# Altium project ARMflash_revC.PrjPcb (part 2 of 4)

## Sheet Pg06_ SysBoot_LEDS_Mech.SchDoc: SYSBOOT LED SENSORS
size A2; DocumentNumber: 6; Revision: C2; SheetNumber: 6; SheetTotal: 16
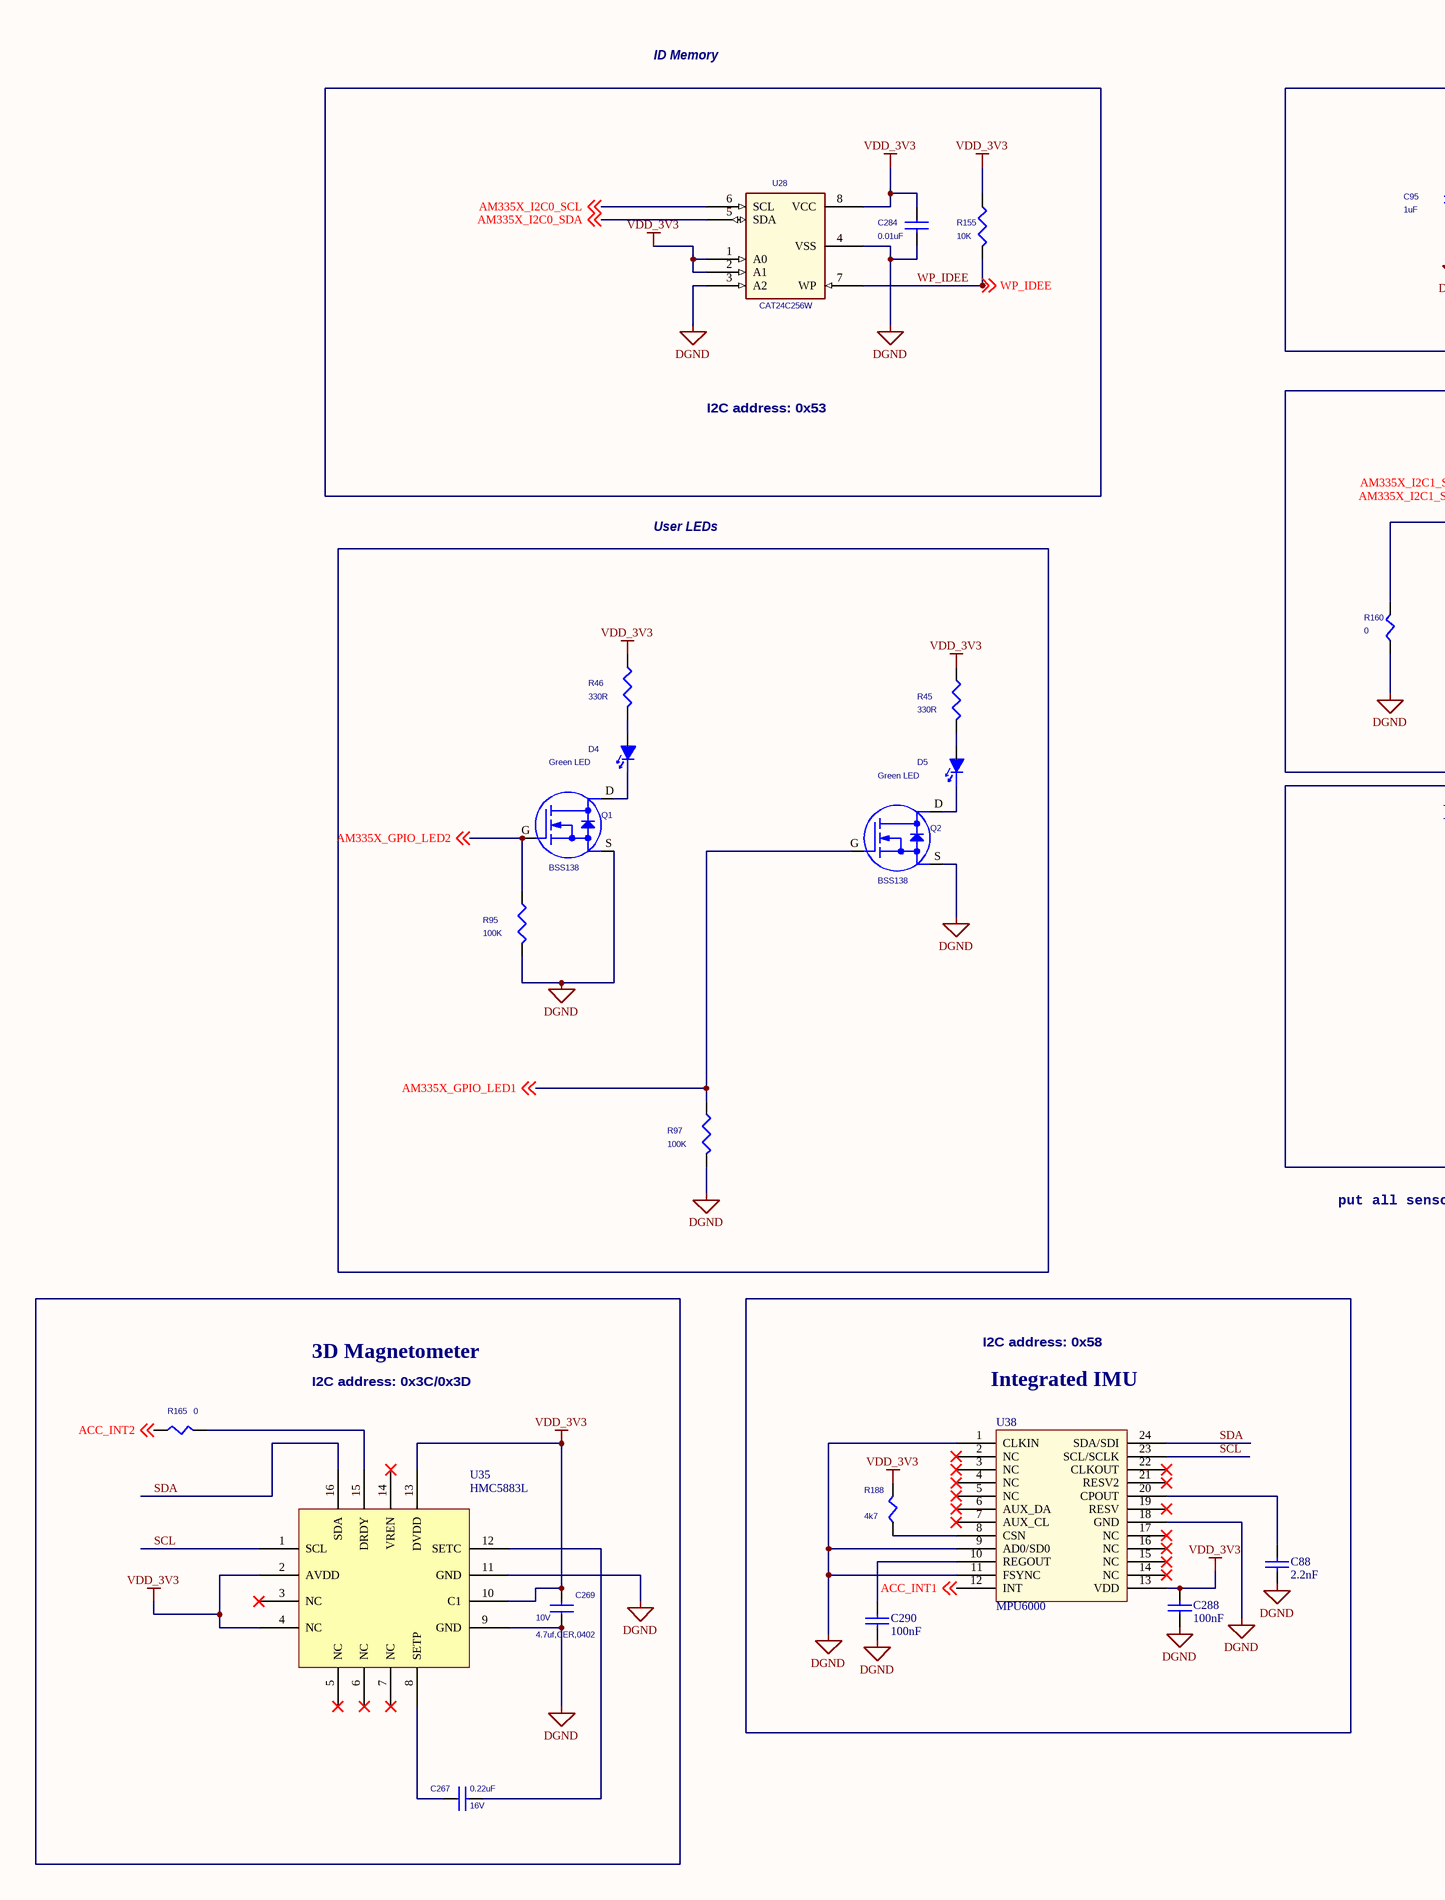
[diagram p7: Pg06_ SysBoot_LEDS_Mech.SchDoc, left]
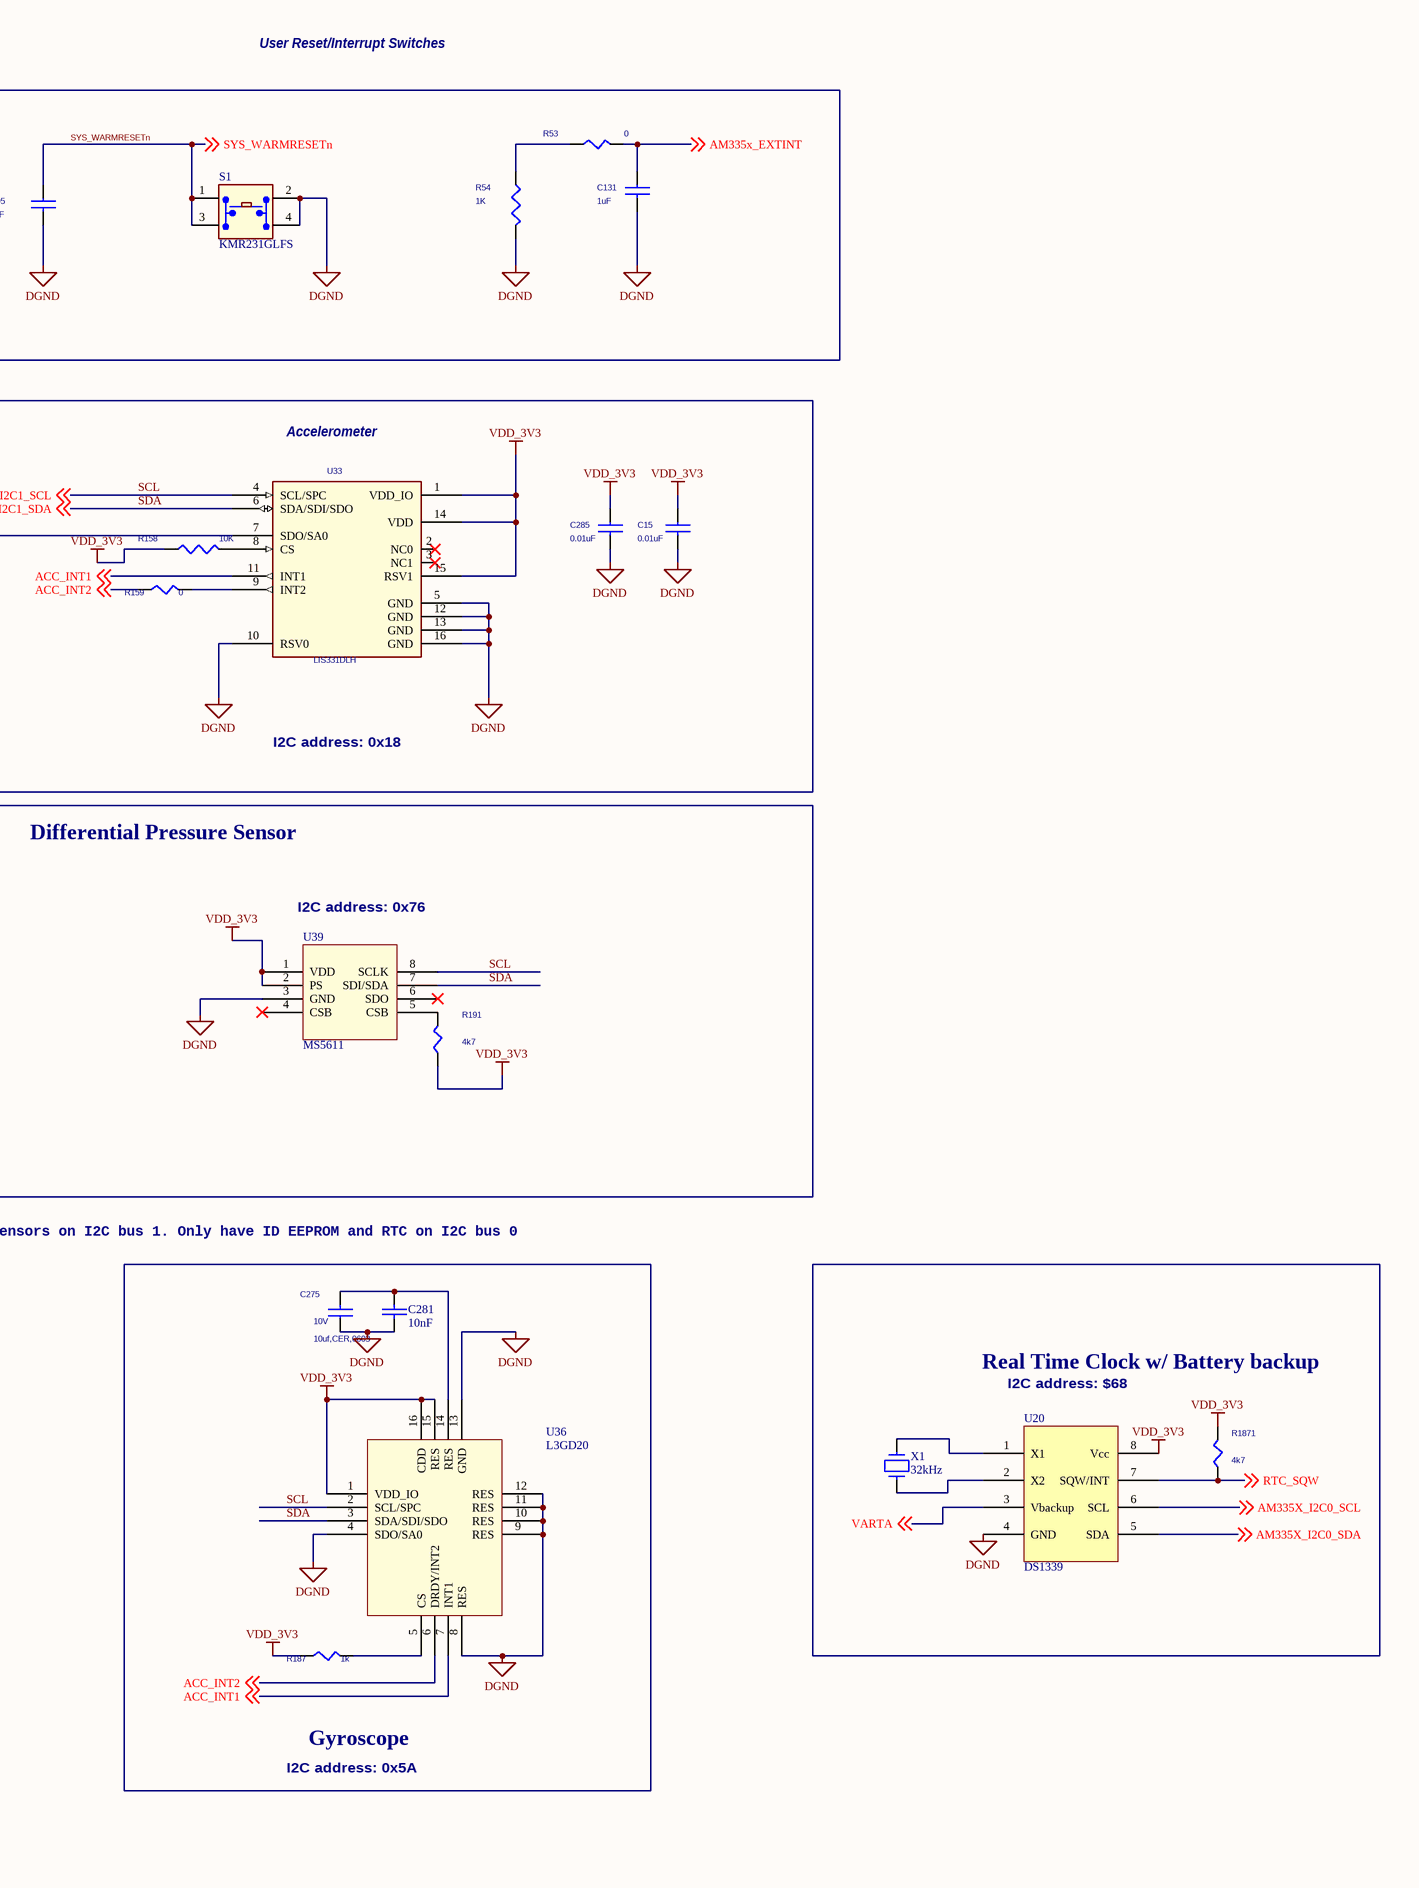
[diagram p8: Pg06_ SysBoot_LEDS_Mech.SchDoc, right]

### Parts
(Parts that share a designator on the sheet are numbered #1, #2 ... from top to bottom, then left to right.)
?#6  (no value)  (graphical)
C15  0.01uF  [SM-7351-CAP-0402]
C88  2.2nF  [0603]
C95  1uF  [SM-7351-CAP-0402]
C131  1uF  [SM-7351-CAP-0402]
C267  0.22uF  Voltage: 16V  [sc0402]
C269  4.7uf,CER,0402  Voltage: 10V  [sc0402]
C275  10uf,CER,0603  Voltage: 10V  [0603]
C281  10nF  [SM-7351-CAP-0402]
C284  0.01uF  [SM-7351-CAP-0402]
C285  0.01uF  [SM-7351-CAP-0402]
C288  100nF  [0603]
C290  100nF  [0603]
D4  Green LED  [sm_led_0805]
D5  Green LED  [sm_led_0805]
Q1  BSS138  [SOT23-3]
Q2  BSS138  [SOT23-3]
R45  330R  [SM-7351-RES-0402]
R46  330R  [SM-7351-RES-0402]
R53  0  [SM-7351-RES-0402]
R54  1K  [SM-7351-RES-0402]
R95  100K  [SM-7351-RES-0402]
R97  100K  [SM-7351-RES-0402]
R155  10K  [SM-7351-RES-0402]
R158  10K  [SM-7351-RES-0402]
R159  0  [SM-7351-RES-0402]
R160  0  [SM-7351-RES-0402]
R165  0  [SM-7351-RES-0402]
R187  1k  [SM-7351-RES-0402]
R188  4k7  [SM-7351-RES-0402]
R191  4k7  [SM-7351-RES-0402]
R1871  4k7  [SM-7351-RES-0402]
S1  KMR231GLFS  [SW4SMD_63X161LS]
U20  DS1339  [MSOP-MS8_N]
U28  CAT24C256W  [SOIC_8]
U33  LIS331DLH  [LGA16pin_3x3]
U35  HMC5883L  [LPCC package]
U36  L3GD20  [LCC 16pin 4x4mm 0.65mm pitch]
U38  MPU6000  [QFN_EPAD_24]
U39  MS5611  [MS5611-01BA03]
X1  32kHz  [Xtal 3215]

### Blocks framed on the sheet
I2C address: 0x53: C284 R155 U28
Accelerometer: C15 C285 R158-R160 U33
User LEDs: D4 D5 Q1 Q2 R45 R46 R95 R97
Differential Pressure Sensor: R191 U39
Gyroscope: C275 C281 R187 U36
Real Time Clock w/ Battery backup: R1871 U20 X1
3D Magnetometer: C267 C269 R165 U35
Integrated IMU: C88 C288 C290 R188 U38

### Nets
DGND: C15.2 C88.2 C95.2 C131.2 C269.1 C275.1 C281.2 C284.2 C285.2 C288.2 C290.2 Q1.S(SOURCE) Q2.S(SOURCE) R54.1(P1) R95.1(P1) R97.1(P1) R160.2(P2) S1.2(A2) S1.4 U20.4(GND) U28.3(A2) U28.4(VSS) U33.5(GND) U33.10(RSV0) U33.12(GND) U33.13(GND) U33.16(GND) U35.9(GND) U35.11(GND) U36.4(SDO/SA0) U36.8(RES) U36.9(RES) U36.10(RES) U36.11(RES) U36.12(RES) U36.13(GND) U38.1(CLKIN) U38.9(AD0/SD0) U38.11(FSYNC) U38.18(GND) U39.3(GND)
VDD_3V3: C15.1 C269.2 C284.1 C285.1 C288.1 R45.2(P2) R46.2(P2) R155.2(P2) R158.2(P2) R187.2(P2) R188.1(P1) R191.2(P2) R1871.1(P1) U20.8(Vcc) U28.1(A0) U28.2(A1) U28.8(VCC) U33.1(VDD_IO) U33.14(VDD) U33.15(RSV1) U35.2(AVDD) U35.4(NC) U35.10(C1) U35.13(DVDD) U36.1(VDD_IO) U36.15(RES) U36.16(CDD) U38.13(VDD) U39.1(VDD) U39.2(PS)  [project net VDD]
ACC_INT1: U33.11(INT1) U36.7(INT1) U38.12(INT) ; off-sheet ACC_INT1
ACC_INT2: R159.2(P2) R165.2(P2) U36.6(DRDY/INT2) ; off-sheet ACC_INT2
AM335x_EXTINT: C131.1 R53.1(P1) ; off-sheet AM335x_EXTINT
AM335X_GPIO_LED1: Q2.G(GATE) R97.2(P2) ; off-sheet AM335X_GPIO_LED1
AM335X_GPIO_LED2: Q1.G(GATE) R95.2(P2) ; off-sheet AM335X_GPIO_LED2  [project net TST1]
AM335X_I2C0_SCL: U20.6(SCL) U28.6(SCL) ; off-sheet AM335X_I2C0_SCL
AM335X_I2C0_SDA: U20.5(SDA) U28.5(SDA) ; off-sheet AM335X_I2C0_SDA
RTC_SQW: R1871.2(P2) U20.7(SQW/INT) ; off-sheet RTC_SQW
SCL: U33.4(SCL/SPC) U35.1(SCL) U36.2(SCL/SPC) U38.23(SCL/SCLK) U39.8(SCLK) ; off-sheet AM335X_I2C1_SCL  [also labelled AM335X_I2C1_SCL]
SDA: U33.6(SDA/SDI/SDO) U35.16(SDA) U36.3(SDA/SDI/SDO) U38.24(SDA/SDI) U39.7(SDI/SDA) ; off-sheet AM335X_I2C1_SDA  [also labelled AM335X_I2C1_SDA]
SYS_WARMRESETn: C95.1 S1.1(A1) S1.3(A3) ; off-sheet SYS_WARMRESETn  [project net ENET_RESETn]
VARTA: U20.3(Vbackup) ; off-sheet VARTA
WP_IDEE: R155.1(P1) U28.7(WP) ; off-sheet WP_IDEE
NetC88_1: C88.1 U38.20(CPOUT)
NetC267_1: C267.1 U35.8(SETP)
NetC267_2: C267.2 U35.12(SETC)
NetC275_2: C275.2 C281.1 U36.14(RES)
NetC290_1: C290.1 U38.10(REGOUT)
NetD4_1: D4.1(Cathode) Q1.D(DRAIN)
NetD4_2: D4.2(Anode) R46.1(P1)
NetD5_1: D5.1(Cathode) Q2.D(DRAIN)
NetD5_2: D5.2(Anode) R45.1(P1)
NetR53_2: R53.2(P2) R54.2(P2)
NetR158_1: R158.1(P1) U33.8(CS)
NetR159_1: R159.1(P1) U33.9(INT2)
NetR160_1: R160.1(P1) U33.7(SDO/SA0)
NetR165_1: R165.1(P1) U35.15(DRDY)
NetR187_1: R187.1(P1) U36.5(CS)
NetR188_2: R188.2(P2) U38.8(CSN)
NetR191_1: R191.1(P1) U39.5(CSB)
NetU20_1: U20.1(X1) X1.2
NetU20_2: U20.2(X2) X1.1

Not connected (* = marked no-connect by the designer): U33 2(NC0)* 3(NC1)*; U35 3(NC)* 5(NC)* 6(NC)* 7(NC)* 14(VREN)*; U38 2(NC)* 3(NC)* 4(NC)* 5(NC)* 6(AUX_DA)* 7(AUX_CL)* 14(NC)* 15(NC)* 16(NC)* 17(NC)* 19(RESV)* 21(RESV2)* 22(CLKOUT)*; U39 4(CSB)* 6(SDO)*

### Notes on the sheet
- ID Memory
- User Reset/Interrupt Switches
- I2C address: 0x18
- I2C address: 0x76
- put all sensors on I2C bus 1. Only have ID EEPROM and RTC on I2C bus 0
- I2C address: 0x3C/0x3D
- I2C address: 0x58
- I2C address: $68
- I2C address: 0x5A
- Embedded Vision Systems Group
- Title
- School of Electrical and Electronic Engineering
- Date:
- Size
- Document Number
- Sheet
- of
- Rev

### Library data of the parts
?#6 = Title Block Address(1): UoM title block
C15 C284 C285 = 0.01uFCapacitor16V10%0402_Dup1: as C4 on sheet Pg04_ AM335X Section 3 
C88 C281 C288 C290 = CAP_CER: Ceramic capacitor
C95 C131 = 1uFCapacitor10V10%0402_Dup1: PartName: 1uF10V10%0402; Mfr: AVX; MfrNum: 0402ZD105KAT2A; TIIntPartnumber: 1C0084; Vendor: Digikey; Cost100: 0.336; Cost10K: 0.201; DescriptiveText: Capacitor 1uF 10V Ceramic 10% 0402
C267 = 0402_0r01uf_x7r_16v_10: TN: 207-0054-000; Desc: CAP, CER, X7R, 0402, 16V, 10%, 0.01uF
C269 C275 = cap_0402_0r1uf_x7r_10v: Desc: CAP, CER, X7R, 0402, 10V, 10%, 0.1uF
D4 D5 = LED_Green: TIIntPartnumber: 1F0008; MfrNum: 598-8170-107F; Mfr: Dialight; PartName: LEDGreen2x1.5; DescriptiveText: LED Green SMD 20mA 2V 0805; Cost10K: 0.0370; Cost100: 0.081; Vendor: Digikey
Q1 Q2 = MOSFET_NChan_BSS138_Dup1: MOSFET Nchan 50V 200mA; TIIntPartnumber: 1Q0019; MfrNum: BSS138-7-F; Mfr: Diodes Inc.; Cost10K: 0.030; Cost100: 0.18; Vendor: Digikey; TN: 289-0091-000; Descriptive_Text: MOSFET Nchan 50V 200mA; PartName: MOSFET_NChan_BSS138; DescriptiveText: MOSFET Nchan 50V 200mA
R45 R46 = 150ohm1/16W1%SMD0402: Resistor 150ohm 1/16W 5% 0402; Mfr: Stackpole Electronics; MfrNum: RMCF0402JT150R; TIIntPartnumber: 1R0179; Vendor: Digikey; Cost100: 0.011; Cost10K: 0.00132; DescriptiveText: Resistor 150ohm 1/16W 5% 0402; PartName: 150ohm1/16W5%0402; Descriptive_Text: Resistor 150ohm 1/16W 5% 0402
R53 = ZeroOhmResistor1/16W0402_Dup1: Resistor Zero ohm Jumper 0402; TIIntPartnumber: 1R0098; MfrNum: ERJ-2GE0R00X; Mfr: Panasonic; PartName: ZeroohmSMD0402; Cost10K: 0.0020; Cost100: 0.08; Vendor: DIGIKEY; Descriptive_Text: Resistor Zero ohm Jumper 0402; DescriptiveText: Resistor Zero ohm Jumper 0402
R54 = 1KOhmResistor1/16W0402_Dup1: Resistor 1Kohm 1/16W 5% 0402; PartName: 1KOHM1/16W5%SMD; Mfr: Panasonic; MfrNum: ERJ-2GEJ102X; TIIntPartnumber: 1R0027; Vendor: DIGIKEY; Cost100: 0.02595; Descriptive_Text: Resistor 1Kohm 1/16W 5% 0402; Cost10K: 0.02595; DescriptiveText: Resistor 1Kohm 1/16W 5% 0402
R95 R97 = 100KOhmResistor1/16W0402_Dup1: TIIntPartnumber: 1R0181; MfrNum: RMCF0402FT100K; Mfr: Stackpole Electronics; PartName: 100Kohm1/16W1%SMD0402; DescriptiveText: Resistor 100Kohm 1/16W 1% 0402; Cost10K: 0.0020; Cost100: 0.0105; Vendor: Digikey
R155 R158 = 10KOhmResistor1/16W0402_Dup1: as R44 on sheet Pg02_ AM335X Section 1 ; Descriptive_Text: Resistor 10Kohm 1/16W 5% 0402; DescriptiveText: Resistor 10Kohm 1/16W 5% 0402
R159 R165 R187 R188 R191 R1871 = ZeroOhmResistor1/16W0402: PartName: ZeroohmSMD0402; Mfr: Panasonic; MfrNum: ERJ-2GE0R00X; TIIntPartnumber: 1R0098; DescriptiveText: Resistor Zero ohm Jumper 0402; Vendor: Digikey; Cost100: 0.08; Cost10K: 0.0020
R160 = ZeroOhmResistor1/16W0402_Dup4: as R67 on sheet Pg03_ AM335X Section 2 ; Descriptive_Text: Resistor Zero ohm Jumper 0402; DescriptiveText: Resistor Zero ohm Jumper 0402
S1 = KMR2: Microminiature Tact Switch for SMT; Manufacturer: C&K Components; Circuit: SPST-NO; Switch Function: Off-Mom; Contact Rating @ Voltage: 0.05A @ 32VDC; Actuator Type: Standard; Actuator Height off PCB, from Pins: 1.90mm; Actuator Orientation: Top Actuated; Outline: 4.60mm x 2.80mm; Illumination: Non-Illuminated; Operating Force: 300gf; Switch Travel: 0.25mm; Mechanical Life: 150,000 Cycles; Supplier 1: Digi-Key; Supplier Part Number 1: 401-1429-6-ND; Manufacturer Part Number: KMR231GLFS; RoHS: RoHS Compliant; Category: Switches; Stock 1: 32289; Pricing 1: 1=0.44, 10=0.416, 25=0.3744, 50=0.3326, 100=0.3188, 250=0.29108, 500=0.2772, 1000=0.22869 (USD); Mounting Type: Surface Mount; Termination Style: Gull Wing; Illumination Voltage (Nominal): -; Illumination Type, Color: -; Ingress Protection: -; Features: Grounding Pin; Packaging: Digi-Reel®; Actuator Material: -; Operating Temperature: -40°C ~ 85°C; ComponentLink1URL: http://www.ck-components.com/index.php?module=media&action=Display&cmpref=14414&lang=en&width=&height=&format=&alt=; ComponentLink1Description: http://www.ck-components.com/index.php?module=media&action=Display&cmpref=14414&lang=en&width=&height=&format=&alt=
U20 = DS1339: DS1339 RTC; Farnell: 1379717
U28 = CAT24C256W: EEPROM 256Kb I2C SOIC8; TIIntPartnumber: 1A0225; MfrNum: CAT24C256WI-G; Mfr: On Semiconductor; Cost10K: 0.36; Cost100: 1.21; Vendor: Digikey; DescriptiveText: EEPROM 256Kb I2C SOIC8; PartName: CAT24C256W; Descriptive_Text: EEPROM 256Kb I2C SOIC8
U33 = LIS331DLH: Accelerometer 3 Axis I2C; Mfr: ST Microelectronics; TIIntPartnumber: 1A0227; Vendor: Digikey; Cost100: 8.05; Cost10K: 2.25; DescriptiveText: Accelerometer 3 Axis I2C; PartName: LIS331DLH; MfrNum: LIS331DLH; Descriptive_Text: Accelerometer 3 Axis I2C
U35 = HMC5883L: 3D Magnetometer
U38 = IMU6000: Invensemse 6-axis MPU; supplier: Digikey  1428-1005-1-ND
U39 = MS5611: Pressure Sensor; supplier: Avnet
X1 = CRYSTAL

## Sheet Pg07_ DDR3_Memory.SchDoc: DDR3 MEMORY
size A2; DrawnBy: RvS; DocumentNumber: 7; Revision: C2; SheetNumber: 7; SheetTotal: 16
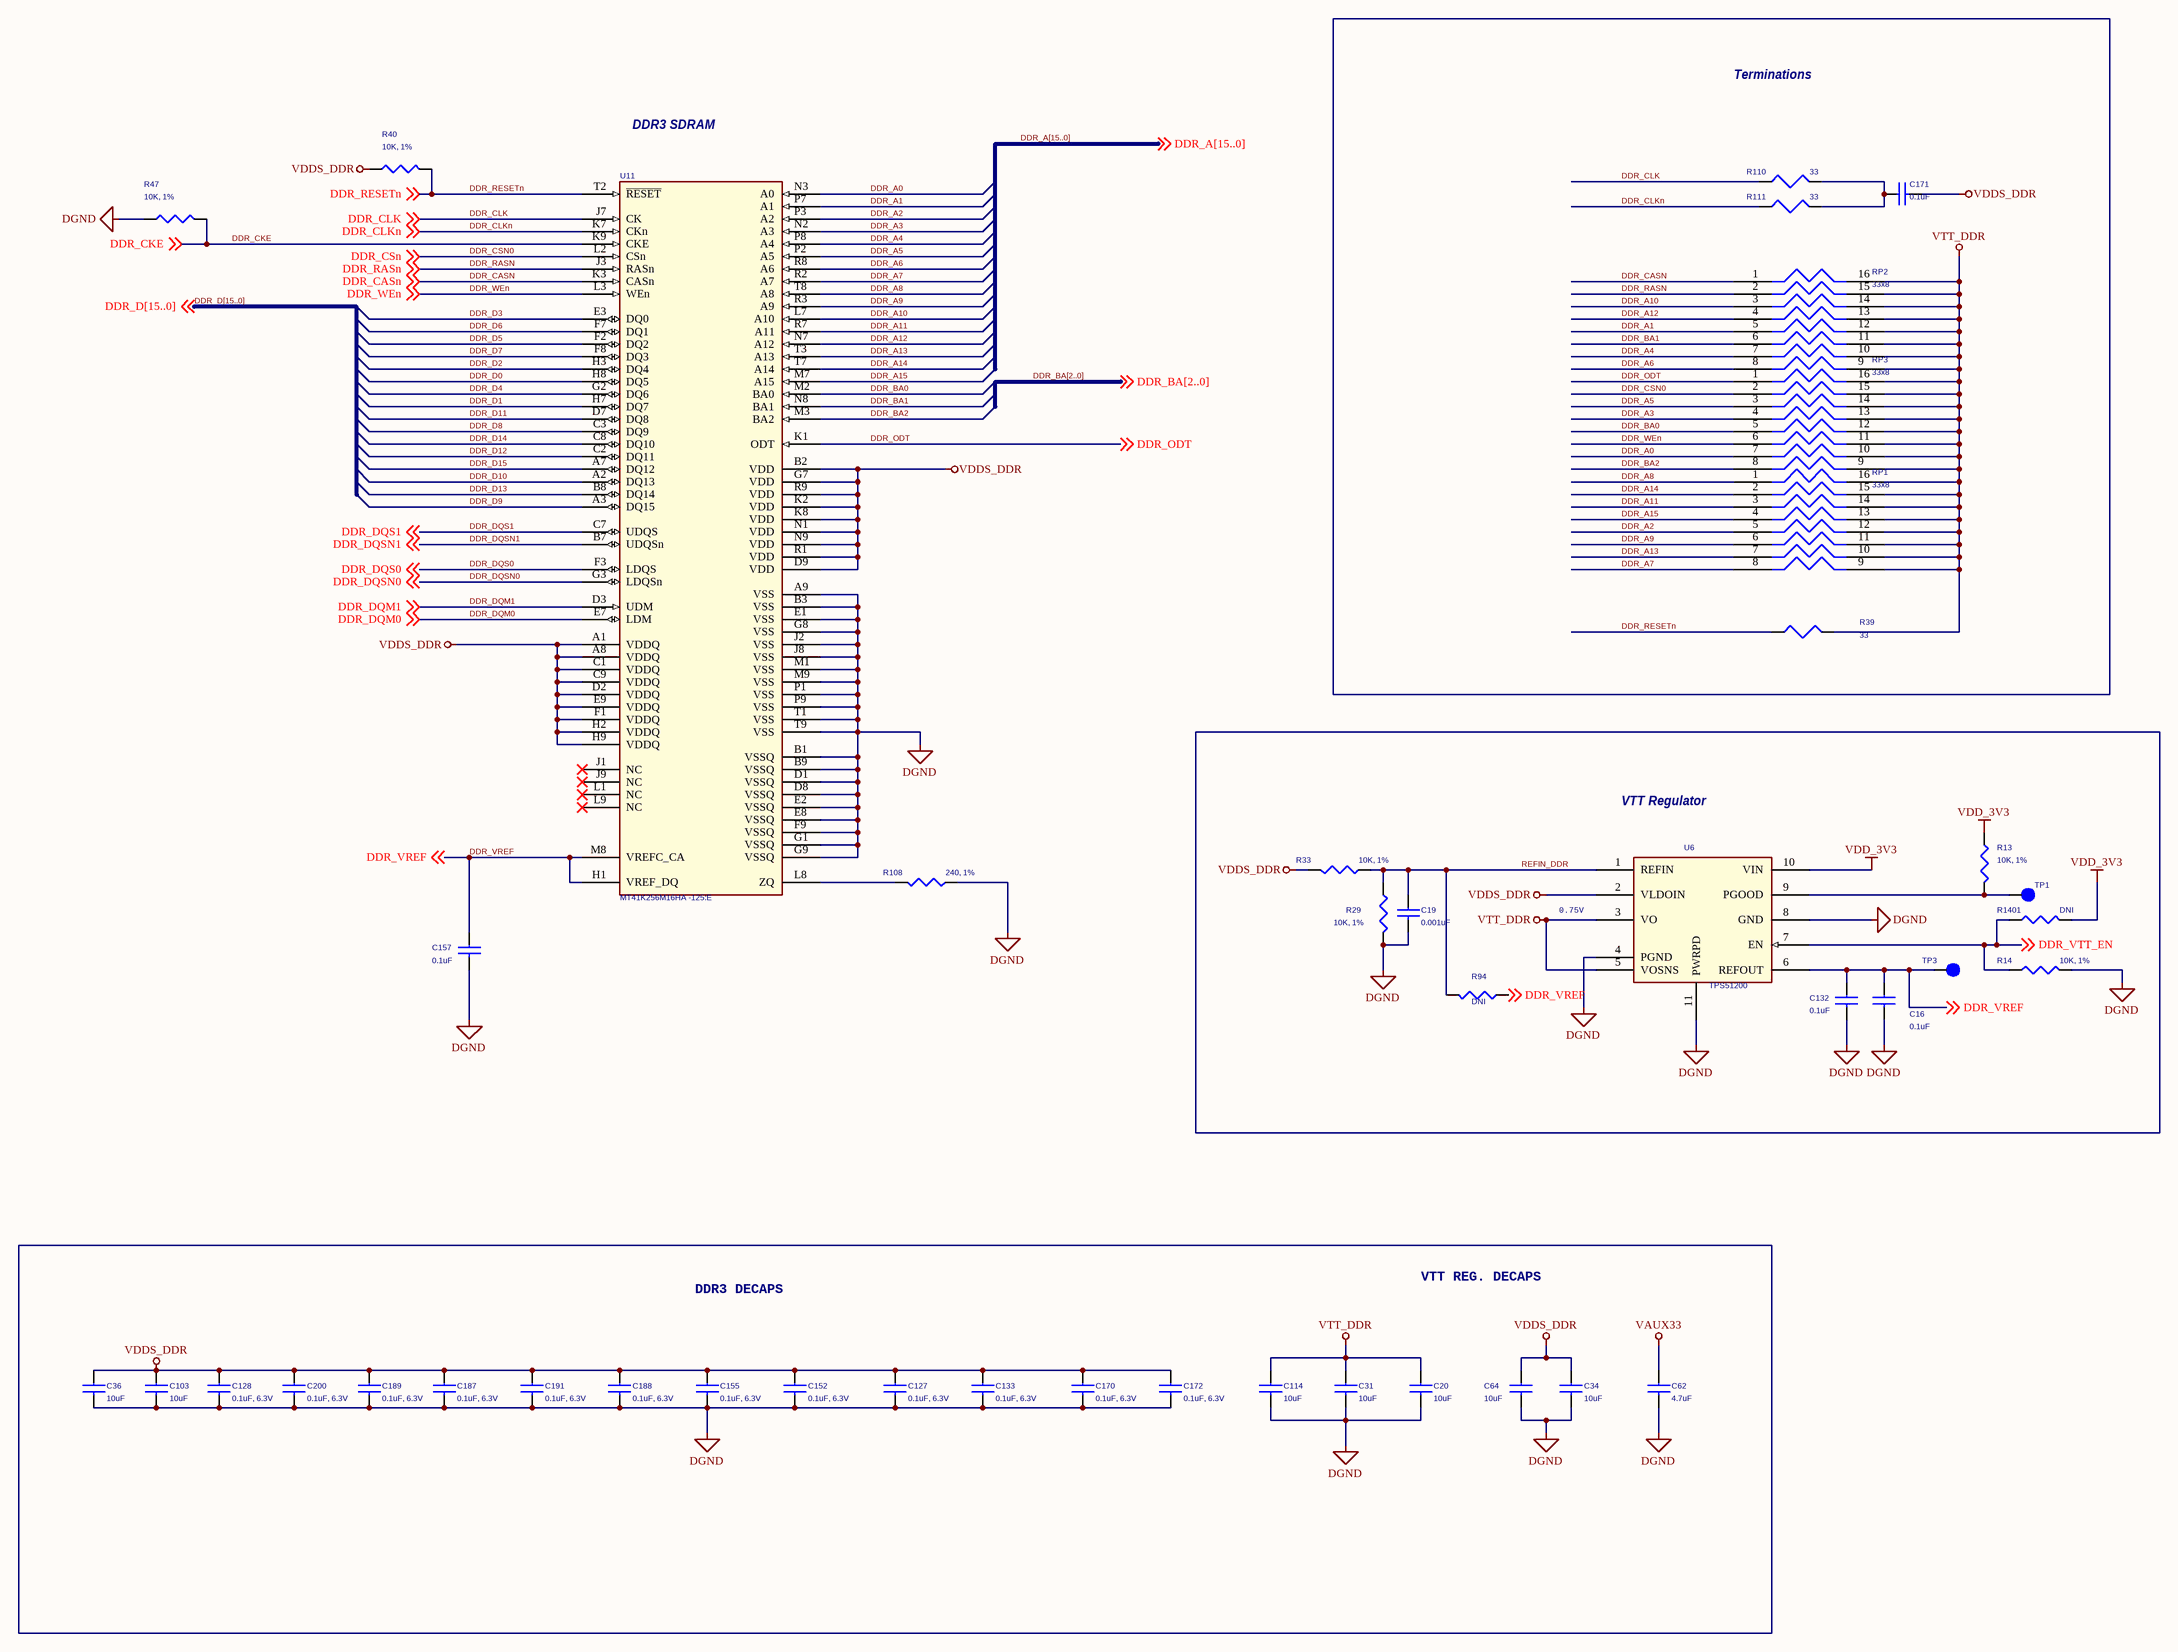
[diagram p9: Pg07_ DDR3_Memory.SchDoc]

### Parts
(Parts that share a designator on the sheet are numbered #1, #2 ... from top to bottom, then left to right.)
?#7  (no value)  (graphical)
C16  0.1uF  [SM-7351-CAP-0402]
C19  0.001uF  [SM-7351-CAP-0402]
C20  10uF  [SM-7351-CAP-0805]
C31  10uF  [SM-7351-CAP-0805]
C34  10uF  [SM-7351-CAP-0805]
C36  10uF  [SM-7351-CAP-0805]
C62  4.7uF  [SM-7351-CAP-0603]
C64  10uF  [SM-7351-CAP-0805]
C103  10uF  [SM-7351-CAP-0805]
C114  10uF  [SM-7351-CAP-0805]
C127  0.1uF, 6.3V  [SM-7351-CAP-0402]
C128  0.1uF, 6.3V  [SM-7351-CAP-0402]
C132  0.1uF  [SM-7351-CAP-0402]
C133  0.1uF, 6.3V  [SMD0201]
C152  0.1uF, 6.3V  [SM-7351-CAP-0402]
C155  0.1uF, 6.3V  [SMD0201]
C157  0.1uF  [SM-7351-CAP-0402]
C170  0.1uF, 6.3V  [SM-7351-CAP-0402]
C171  0.1uF  [SM-7351-CAP-0402]
C172  0.1uF, 6.3V  [SM-7351-CAP-0402]
C187  0.1uF, 6.3V  [SM-7351-CAP-0402]
C188  0.1uF, 6.3V  [SM-7351-CAP-0402]
C189  0.1uF, 6.3V  [SM-7351-CAP-0402]
C191  0.1uF, 6.3V  [SM-7351-CAP-0402]
C200  0.1uF, 6.3V  [SMD0201]
R13  10K, 1%  [SM-7351-RES-0402]
R14  10K, 1%  [SM-7351-RES-0402]
R29  10K, 1%  [SM-7351-RES-0402]
R33  10K, 1%  [SM-7351-RES-0402]
R39  33  [SM-7351-RES-0402]
R40  10K, 1%  [SM-7351-RES-0402]
R47  10K, 1%  [SM-7351-RES-0402]
R94  DNI  [SM-7351-RES-0402]
R108  240, 1%  [SM-7351-RES-0402]
R110  33  [SM-7351-RES-0402]
R111  33  [SM-7351-RES-0402]
R1401  DNI  [SM-7351-RES-0402]
RP1  33x8  [sm_rpak_exb-2hv]
RP2  33x8  [sm_rpak_exb-2hv]
RP3  33x8  [sm_rpak_exb-2hv]
TP1  TP1mm  [tp_smd1mmcircle]  (value not drawn)
TP3  TP1mm  [tp_smd1mmcircle]  (value not drawn)
U6  TPS51200  [SON10]
U11  MT41K256M16HA -125:E  [BGA14X10-96]

### Blocks framed on the sheet
Terminations: C171 R39 R110 R111 RP1-RP3
VTT Regulator: C16 C19 C132 R13 R14 R29 R33 R94 R1401 TP1 TP3 U6

### Nets
DGND: C16.2 C19.2 C20.2 C31.2 C34.2 C36.2 C62.2 C64.2 C103.2 C114.2 C127.2 C128.2 C132.2 C133.2 C152.2 C155.2 C157.2 C170.2 C172.2 C187.2 C188.2 C189.2 C191.2 C200.2 R14.2 R29.2 R47.1 R108.1 U6.4(PGND) U6.8(GND) U6.11(PWRPD) U11.A9(VSS) U11.B1(VSSQ) U11.B3(VSS) U11.B9(VSSQ) U11.D1(VSSQ) U11.D8(VSSQ) U11.E1(VSS) U11.E2(VSSQ) U11.E8(VSSQ) U11.F9(VSSQ) U11.G1(VSSQ) U11.G8(VSS) U11.G9(VSSQ) U11.J2(VSS) U11.J8(VSS) U11.M1(VSS) U11.M9(VSS) U11.P1(VSS) U11.P9(VSS) U11.T1(VSS) U11.T9(VSS)
VAUX33: C62.1
VDD_3V3: R13.1 R1401.2 U6.10(VIN)  [project net VDD]
VDDS_DDR: C34.1 C36.1 C64.1 C103.1 C127.1 C128.1 C133.1 C152.1 C155.1 C170.1 C171.2 C172.1 C187.1 C188.1 C189.1 C191.1 C200.1 R33.2 R40.1 U6.2(VLDOIN) U11.A1(VDDQ) U11.A8(VDDQ) U11.B2(VDD) U11.C1(VDDQ) U11.C9(VDDQ) U11.D2(VDDQ) U11.D9(VDD) U11.E9(VDDQ) U11.F1(VDDQ) U11.G7(VDD) U11.H2(VDDQ) U11.H9(VDDQ) U11.K2(VDD) U11.K8(VDD) U11.N1(VDD) U11.N9(VDD) U11.R1(VDD) U11.R9(VDD)
VTT_DDR: C20.1 C31.1 C114.1 R39.2 RP1.9 RP1.10 RP1.11 RP1.12 RP1.13 RP1.14 RP1.15 RP1.16 RP2.9 RP2.10 RP2.11 RP2.12 RP2.13 RP2.14 RP2.15 RP2.16 RP3.9 RP3.10 RP3.11 RP3.12 RP3.13 RP3.14 RP3.15 RP3.16 U6.3(VO) U6.5(VOSNS)
DDR_A0: RP3.7 U11.N3(A0)
DDR_A1: RP2.5 U11.P7(A1)
DDR_A2: RP1.5 U11.P3(A2)
DDR_A3: RP3.4 U11.N2(A3)
DDR_A4: RP2.7 U11.P8(A4)
DDR_A5: RP3.3 U11.P2(A5)
DDR_A6: RP2.8 U11.R8(A6)
DDR_A7: RP1.8 U11.R2(A7)
DDR_A8: RP1.1 U11.T8(A8)
DDR_A9: RP1.6 U11.R3(A9)
DDR_A10: RP2.3 U11.L7(A10)
DDR_A11: RP1.3 U11.R7(A11)
DDR_A12: RP2.4 U11.N7(A12)
DDR_A13: RP1.7 U11.T3(A13)
DDR_A14: RP1.2 U11.T7(A14)
DDR_A15: RP1.4 U11.M7(A15)
DDR_BA0: RP3.5 U11.M2(BA0)
DDR_BA1: RP2.6 U11.N8(BA1)
DDR_BA2: RP3.8 U11.M3(BA2)
DDR_CASn: RP2.1 U11.K3(CASn) ; off-sheet DDR_CASn
DDR_CKE: R47.2 U11.K9(CKE) ; off-sheet DDR_CKE
DDR_CLK: R110.1 U11.J7(CK) ; off-sheet DDR_CLK
DDR_CLKn: R111.1 U11.K7(CKn) ; off-sheet DDR_CLKn
DDR_CSn: RP3.2 U11.L2(CSn) ; off-sheet DDR_CSn  [also labelled DDR_CSN0]
DDR_D0: U11.H8(DQ5)
DDR_D1: U11.H7(DQ7)
DDR_D2: U11.H3(DQ4)
DDR_D3: U11.E3(DQ0)
DDR_D4: U11.G2(DQ6)
DDR_D5: U11.F2(DQ2)
DDR_D6: U11.F7(DQ1)
DDR_D7: U11.F8(DQ3)
DDR_D8: U11.C3(DQ9)
DDR_D9: U11.A3(DQ15)
DDR_D10: U11.A2(DQ13)
DDR_D11: U11.D7(DQ8)
DDR_D12: U11.C2(DQ11)
DDR_D13: U11.B8(DQ14)
DDR_D14: U11.C8(DQ10)
DDR_D15: U11.A7(DQ12)
DDR_DQM0: U11.E7(LDM) ; off-sheet DDR_DQM0
DDR_DQM1: U11.D3(UDM) ; off-sheet DDR_DQM1
DDR_DQS0: U11.F3(LDQS) ; off-sheet DDR_DQS0
DDR_DQS1: U11.C7(UDQS) ; off-sheet DDR_DQS1
DDR_DQSN0: U11.G3(LDQSn) ; off-sheet DDR_DQSN0
DDR_DQSN1: U11.B7(UDQSn) ; off-sheet DDR_DQSN1
DDR_ODT: RP3.1 U11.K1(ODT) ; off-sheet DDR_ODT
DDR_RASn: RP2.2 U11.J3(RASn) ; off-sheet DDR_RASn
DDR_RESETn: R39.1 R40.2 U11.T2(~{RESET}) ; off-sheet DDR_RESETn
DDR_VREF: C16.1 C132.1 C157.1 R94.1 TP3.1 U6.6(REFOUT) U11.H1(VREF_DQ) U11.M8(VREFC_CA) ; off-sheet DDR_VREF
DDR_VTT_EN: R14.1 R1401.1 U6.7(EN) ; off-sheet DDR_VTT_EN
DDR_WEn: RP3.6 U11.L3(WEn) ; off-sheet DDR_WEn
REFIN_DDR: C19.1 R29.1 R33.1 R94.2 U6.1(REFIN)
NetC171_1: C171.1 R110.2 R111.2
NetR13_2: R13.2 TP1.1 U6.9(PGOOD)
NetR108_2: R108.2 U11.L8(ZQ)

Not connected (* = marked no-connect by the designer): U11 J1(NC)* J9(NC)* L1(NC)* L9(NC)*

### Buses and harness runs
bus DDR_A[15..0]
bus DDR_BA[2..0]
bus DDR_D[15..0]

### Notes on the sheet
- DDR3 SDRAM
- 0.75V
- VTT REG. DECAPS
- DDR3 DECAPS
- Embedded Vision Systems Group
- Title
- School of Electrical and Electronic Engineering
- Date:
- Size
- Document Number
- Sheet
- of
- Rev

### Library data of the parts
?#7 = Title Block Address(1): UoM title block
C16 C132 C157 C171 = 0.1uFCapacitor16V10%0402_Dup1: TIIntPartnumber: 1C0089; MfrNum: C0402C104K4RACT; Mfr: Kemet; PartName: 0.1uF16V10%SMD0402; DescriptiveText: Capacitor 0.1uF 16V 10% 0402 X7R; Cost10K: 0.015; Cost100: 0.11; Vendor: Digikey
C19 = 0.001uFCapacitor50V5%0402: Mfr: AVX; PartName: 0.001uF50V5%SMD0402; MfrNum: 04025C102JAT2A; TIIntPartnumber: 1C0093; PN: 0402YC103KAT2A; TN: 207-0054-000; Vendor: Digikey; Cost100: 0.015; Cost10K: 0.007; DescriptiveText: Capacitor 0.001uF 50V 5% 0402
C20 C31 C34 C36 C64 C103 C114 = 10uFCapacitor16V10%0805: Capacitor 10uF 16V 10% Ceramic 0805; PartName: 10uF16V10%SMD0805; Mfr: AVX; MfrNum: 0805YD106KAT2A; TIIntPartnumber: 1C0085; Vendor: Digikey; Cost100: 0.19; Cost10K: 0.042; Descriptive_Text: Capacitor 10uF 16V 10% Ceramic 0805; DescriptiveText: Capacitor 10uF 16V 10% Ceramic 0805
C62 = 4.7uFCapacitor16V10%0603: TIIntPartnumber: 1C0103; MfrNum: EMK107ABJ475KA-T; Mfr: Taiyo Yuden; PartName: 4.7uF16V10%SMD0603; Cost10K: 0.00590; Cost100: 0.0198; Vendor: Digikey; DescriptiveText: Capacitor Ceramic 4.7uF 16V 10% 0603
C127 C128 C133 C152 C155 C170 C172 C187-C189 C191 C200 = 0.1uFCapacitor6.3V10%0201: PartName: 0.1uF6.3V10%smd0201; Mfr: Murata; MfrNum: GRM033R60J104KE19D; TIIntPartnumber: 1C0122; Vendor: Digikey; Cost100: 0.029; Cost10K: 0.0090; DescriptiveText: Capacitor 0.1uF 6.3V 10% 0201 X5R
R13 R29 R33 R94 = 10KOhmResistor1/10W1%0402_Dup3: TIIntPartnumber: 1R0254; MfrNum: ERJ-2RKF1002X; Mfr: Panasonic-ECG; PartName: 10Kohm1/10W1%smd0402; DescriptiveText: Resistor 10Kohm 1/10W 1% 0402; Cost10K: 0.00291; Cost100: 0.011; Vendor: Digikey
R14 R1401 = 10KOhmResistor1/10W1%0402: TIIntPartnumber: 1R0254; MfrNum: ERJ-2RKF1002X; Mfr: Panasonic-ECG; PartName: 10Kohm1/10W1%smd0402; DescriptiveText: Resistor 10Kohm 1/10W 1% 0402; Cost10K: 0.00291; Cost100: 0.011; Vendor: Digikey
R39 R110 R111 = 33ohmResistor1/16W5%0402: Resistor 33ohm 1/16W 5% 0402; PartName: 33ohm1/16W5%SMD; Mfr: Panasonic; MfrNum: ERJ-2GEJ330X; TIIntPartnumber: 1R0008; Vendor: Digikey; Cost100: 0.02595; Cost10K: 0.0020; Descriptive_Text: Resistor 33ohm 1/16W 5% 0402; DescriptiveText: Resistor 33ohm 1/16W 5% 0402
R40 R47 = 10KOhmResistor1/10W1%0402_Dup1: TIIntPartnumber: 1R0254; MfrNum: ERJ-2RKF1002X; Mfr: PANASONIC-ECG; PartName: 10Kohm1/10W1%smd0402; DescriptiveText: Resistor 10Kohm 1/10W 1% 0402; Cost10K: 0.00291; Cost100: 0.011; Vendor: DIGIKEY
R108 = 240OhmResistor1/10W1%0402: PartName: 240ohm1/10W1%smd0402; Mfr: Panasonic-ECG; MfrNum: ERJ-2RKF2400X; TIIntPartnumber: 1R0249; Vendor: Digikey; Cost100: 0.02; Cost10K: 0.00132; DescriptiveText: Resistor 240 OHM 1/10W 1% 0402 SMD
RP1-RP3 = 33ohmx8_1/16W5%smd: Resistor 33ohmx8 1/16W 5% Array SMD; Mfr: Panasonic; MfrNum: EXB-2HV330JV; TIIntPartnumber: 1R0196; Vendor: Digikey; Cost100: 0.007; Cost10K: 0.02465; DescriptiveText: Resistor 33ohmx8 1/16W 5% Array SMD; PartName: 33ohmx8_1/16W5%smd; Descriptive_Text: Resistor 33ohmx8 1/16W 5% Array SMD
TP1 TP3 = Testpoint_SMD1mmCircle: Testpoint SMD 1mm circle pad; TIIntPartnumber: 2H0046; Cost10K: 0.00; Cost100: 0; Descriptive_Text: Testpoint SMD 1mm circle pad; Vendor: N/A; MfrNum: N/A; Mfr: N/A; PartName: TestpointSMD1mmCircle; DescriptiveText: Testpoint SMD 1mm circle pad
U6 = TPS51200: TIIntPartnumber: 1A0297; MfrNum: TPS51200DRC; Mfr: TI; Cost10K: 0.39; Cost100: 1.11; Vendor: Digikey; DescriptiveText: DDR Termination Regulator SinkSource; PartName: TPS51200
U11 = MT41K256M16HA: DDR2 SDRAM 2Gb (256Mx8); Manufacturer: Micron Technology; Lead Time: 0 weeks; Peak Solder Temperature: 260 deg C; Supplier 1: Arrow; Supplier Part Number 1: 52128708S9959891N2406; Manufacturer Part Number: MT41K256M16HA-125:E; RoHS: CHINA ROHS: Compliant / EU ROHS: Compliant; Stock 1: 0; Pricing 1: 0=10.09 (USD); Package Quantity: 1; Termination Finish: Sn/Ag/Cu; China ROHS Lead (X -> above / O -> below threshold): O; China ROHS Mercury (X -> above / O -> below threshold): O; China ROHS Cadmium (X -> above / O -> below threshold): O; China ROHS Hex Chromium (X -> above / O -> below threshold): O; China ROHS PBB (X -> above / O -> below threshold): O; China ROHS PBDE (X -> above / O -> below threshold): O; EU_ROHS_PROD_EXEMPTION_BY_SUPP: N/R; ComponentLink1URL: http://components.arrow.com/partservice/dataview/altium/52128708S9959891N2406?apiKey=aa438727d59eed98c4bed826d8d949c84cb5e685b92bf87346a0226bd2658797; ComponentLink1Description: http://components.arrow.com/partservice/dataview/altium/52128708S9959891N2406?apiKey=aa438727d59eed98c4bed826d8d949c84cb5e685b92bf87346a0226bd2658797

## Sheet Pg08_HDMI.SchDoc: HDMI FRAMER CONNECTIVITY
size A3; DrawnBy: RvS; DocumentNumber: 8; Revision: C2; SheetNumber: 8; SheetTotal: 16
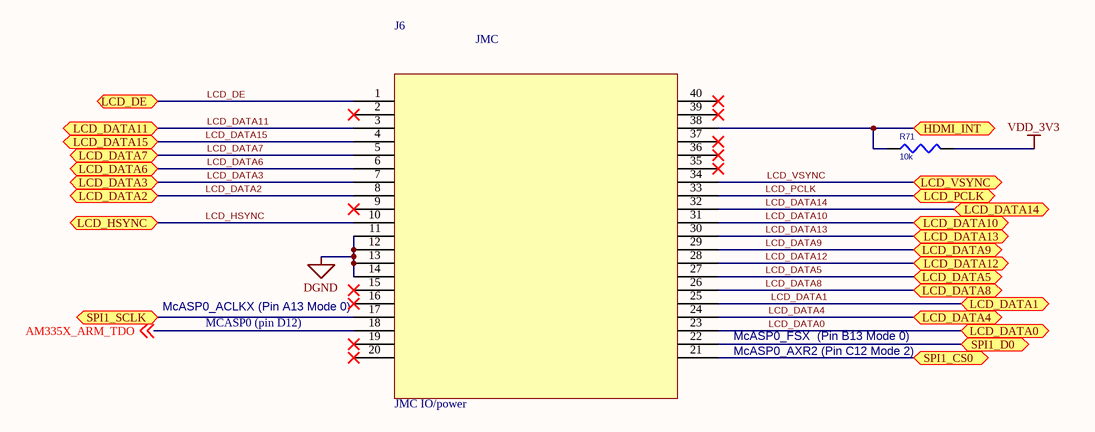
[diagram p10: Pg08_HDMI.SchDoc]

### Parts
(Parts that share a designator on the sheet are numbered #1, #2 ... from top to bottom, then left to right.)
?#8  (no value)  (graphical)
J6  JMC IO/power  [40 Pin Female]
R71  10k  [402]

### Ports
HDMI_INT, LCD_DATA0, LCD_DATA1, LCD_DATA2, LCD_DATA3, LCD_DATA4, LCD_DATA5, LCD_DATA6, LCD_DATA7, LCD_DATA8, LCD_DATA9, LCD_DATA10, LCD_DATA11, LCD_DATA12, LCD_DATA13, LCD_DATA14, LCD_DATA15, LCD_DE, LCD_HSYNC, LCD_PCLK, LCD_VSYNC, SPI1_CS0, SPI1_D0, SPI1_SCLK

### Nets
DGND: J6.11 J6.12 J6.13 J6.14
VDD_3V3: R71.1(P1)  [project net VDD]
AM335X_ARM_TDO: J6.18 ; off-sheet AM335X_ARM_TDO  [project net ARM_TDO]
LCD_DATA0: J6.23 ; port LCD_DATA0  [project net AM335X_LCD_DATA0]
LCD_DATA1: J6.25 ; port LCD_DATA1  [project net AM335X_LCD_DATA1]
LCD_DATA2: J6.8 ; port LCD_DATA2  [project net AM335X_LCD_DATA2]
LCD_DATA3: J6.7 ; port LCD_DATA3  [project net AM335X_LCD_DATA3]
LCD_DATA4: J6.24 ; port LCD_DATA4  [project net AM335X_LCD_DATA4]
LCD_DATA5: J6.27 ; port LCD_DATA5  [project net AM335X_LCD_DATA5]
LCD_DATA6: J6.6 ; port LCD_DATA6  [project net AM335X_LCD_DATA6]
LCD_DATA7: J6.5 ; port LCD_DATA7  [project net AM335X_LCD_DATA7]
LCD_DATA8: J6.26 ; port LCD_DATA8  [project net AM335X_LCD_DATA8]
LCD_DATA9: J6.29 ; port LCD_DATA9  [project net AM335X_LCD_DATA9]
LCD_DATA10: J6.31 ; port LCD_DATA10  [project net AM335X_LCD_DATA10]
LCD_DATA11: J6.3 ; port LCD_DATA11  [project net AM335X_LCD_DATA11]
LCD_DATA12: J6.28 ; port LCD_DATA12  [project net AM335X_LCD_DATA12]
LCD_DATA13: J6.30 ; port LCD_DATA13  [project net AM335X_LCD_DATA13]
LCD_DATA14: J6.32 ; port LCD_DATA14  [project net AM335X_LCD_DATA14]
LCD_DATA15: J6.4 ; port LCD_DATA15  [project net AM335X_LCD_DATA15]
LCD_DE: J6.1 ; port LCD_DE
LCD_HSYNC: J6.10 ; port LCD_HSYNC
LCD_PCLK: J6.33 ; port LCD_PCLK
LCD_VSYNC: J6.34 ; port LCD_VSYNC
TST6: J6.38 R71.2(P2) ; port HDMI_INT
NetJ6_17: J6.17 ; port SPI1_SCLK
NetJ6_21: J6.21 ; port SPI1_CS0
NetJ6_22: J6.22 ; port SPI1_D0

Not connected (* = marked no-connect by the designer): J6 2* 9* 15* 16* 19* 20* 35* 36* 37* 39* 40*

### Notes on the sheet
- McASP0_ACLKX (Pin A13 Mode 0)
- MCASP0 (pin D12)
- McASP0_FSX  (Pin B13 Mode 0)
- McASP0_AXR2 (Pin C12 Mode 2)
- Embedded Vision Systems Group
- School of Electrical and Electronic Engineering
- Size
- Title
- Document Number
- Rev
- Date:
- Sheet
- of
- (in symbol JMC 40-pin) JMC

### Library data of the parts
?#8 = Title Block Address(1): UoM title block
J6 = JMC 40-pin: JST JMC 40 pin connector
R71 = RES SMD: RES 10K OHM 1/16W 5% 0402 SMD; Manufacturer: Rohm Semiconductor; Manufacturer Part Number: MCR01MZPJ103; Power (Watts): 0.063W, 1/16W; Temperature Coefficient: ±200ppm/°C; Supplier 1: Digi-Key; Supplier Part Number 1: RHM10KJDKR-ND; RoHS: RoHS Compliant; Category: Resistors; Stock 1: 460442; Pricing 1: 1=0.1, 10=0.019, 25=0.014, 100=0.0078, 250=0.00596, 500=0.00476, 1000=0.0035, 5000=0.00251 (USD); Resistance (Ohms): 10k; Composition: Thick Film; Features: Automotive AEC-Q200 Qualified; Tolerance: ±5%; Package / Case: 0402 (1005 Metric); Supplier Device Package: 0402 (1005 Metric); Size / Dimension: 0.039" L x 0.020" W (1.00mm x 0.50mm); Height: 0.016" (0.40mm); Number of Terminations: 2; Packaging: Digi-Reel®; ComponentLink1URL: http://rohmfs.rohm.com/en/products/databook/datasheet/passive/resistor/chip_resistor/mcr_a.pdf; ComponentLink1Description: http://rohmfs.rohm.com/en/products/databook/datasheet/passive/resistor/chip_resistor/mcr_a.pdf

## Sheet Pg09_1G_b.SchDoc: 10/100/1G PHY
size A3; DocumentNumber: 9; Revision: C2; SheetNumber: 9; SheetTotal: 16
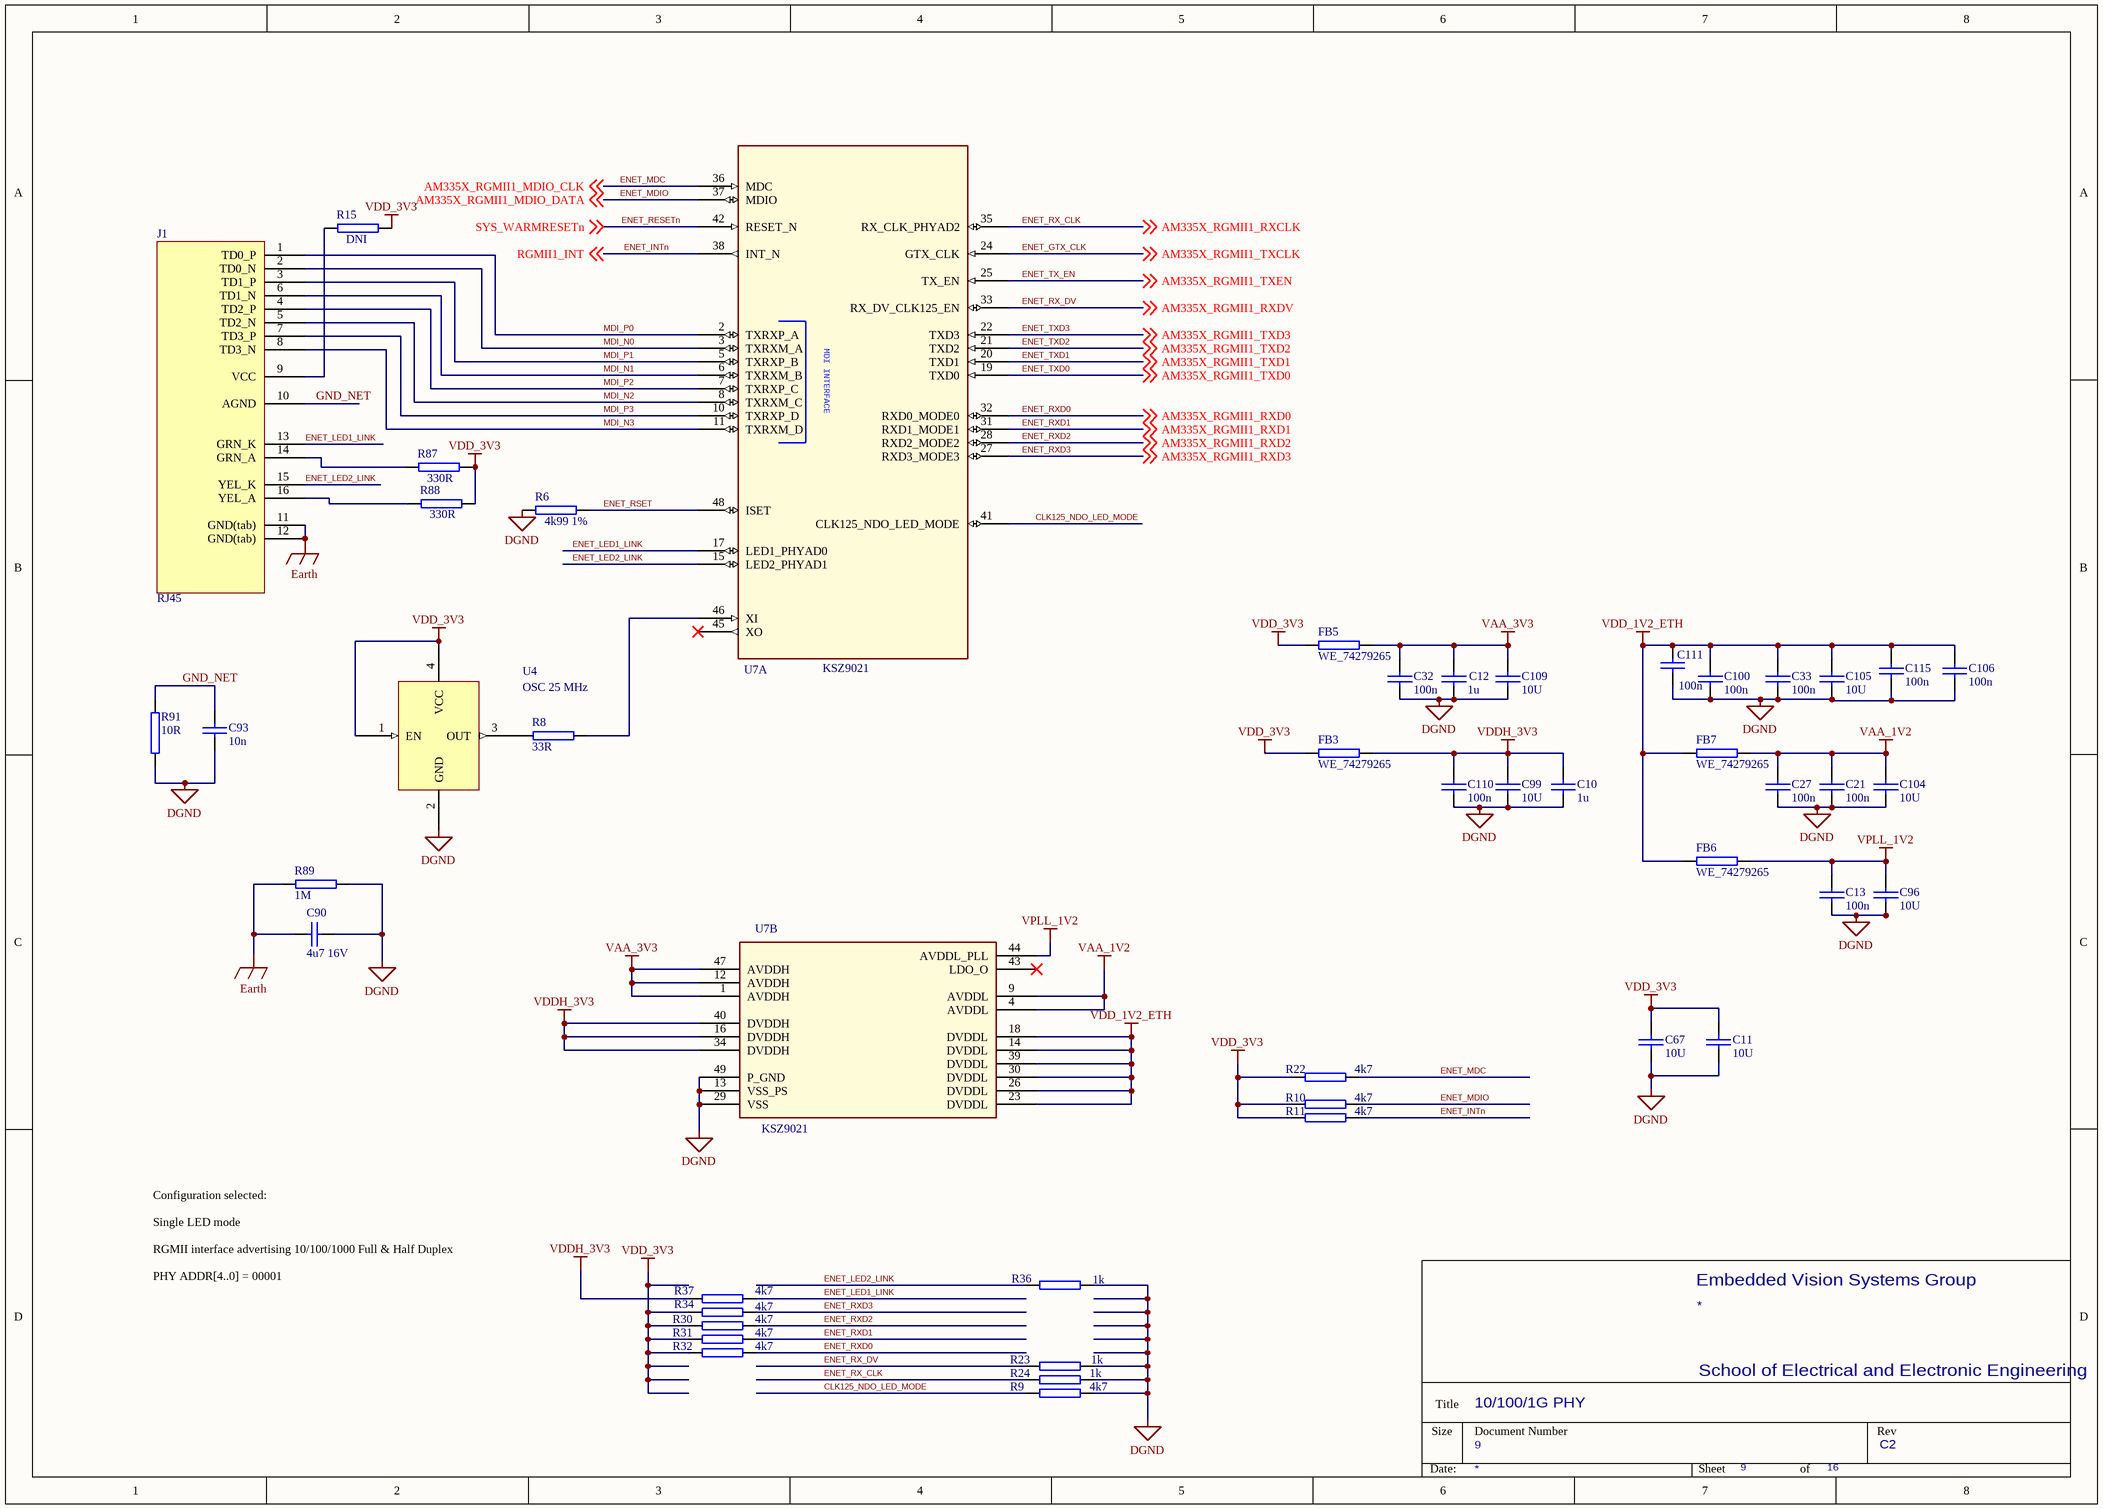
[diagram p11: Pg09_1G_b.SchDoc]

### Parts
(Parts that share a designator on the sheet are numbered #1, #2 ... from top to bottom, then left to right.)
?#9  (no value)  (graphical)
C10  1u  [0603]
C11  10U  [0603]
C12  1u  [0603]
C13  100n  [SM-7351-CAP-0402]
C21  100n  [SM-7351-CAP-0402]
C27  100n  [SM-7351-CAP-0402]
C32  100n  [0603]
C33  100n  [sc0402]
C67  10U  [0603]
C90  4u7 16V  [0603]
C93  10n  [0603]
C96  10U  [0603]
C99  10U  [0603]
C100  100n  [SM-7351-CAP-0402]
C104  10U  [0603]
C105  10U  [0603]
C106  100n  [0603]
C109  10U  [0603]
C110  100n  [0603]
C111  100n  [0603]
C115  100n  [SM-7351-CAP-0402]
FB3  WE_74279265  [0603]
FB5  WE_74279265  [0603]
FB6  WE_74279265  [0603]
FB7  WE_74279265  [0603]
J1  RJ45  [RJ45_tripleSpeed]
R6  4k99 1%  [sc0402]
R8  33R  [sc0402]
R9  4k7  [sc0402]
R10  4k7  [sc0402]
R11  4k7  [sc0402]
R15  DNI  [sc0402]
R22  4k7  [sc0402]
R23  1k  [sc0402]
R24  1k  [sc0402]
R30  4k7  [sc0402]
R31  4k7  [sc0402]
R32  4k7  [sc0402]
R34  4k7  [sc0402]
R36  1k  [sc0402]
R37  4k7  [sc0402]
R87  330R  [sc0402]
R88  330R  [sc0402]
R89  1M  [0603]
R91  10R  [0603]
U4  OSC 25 MHz  [Osc 3.2x2.5]
U7  KSZ9021  [QFN48_0.5mmPitch]  (parts A,B of 2)

### Nets
DGND: C10.2 C11.2 C12.2 C13.2 C21.2 C27.2 C32.2 C33.2 C67.2 C90.2 C93.2 C96.2 C99.2 C100.2 C104.2 C105.2 C106.2 C109.2 C110.2 C111.2 C115.2 R6.1 R9.2 R23.2 R24.2 R36.2 R89.1 R91.1 U4.2(GND) U7.13(VSS_PS) U7.29(VSS) U7.49(P_GND)
Earth: C90.1 J1.11(GND(tab)) J1.12(GND(tab)) R89.2
VAA_1V2: C21.1 C27.1 C104.1 FB7.2 U7.4(AVDDL) U7.9(AVDDL)
VAA_3V3: C12.1 C32.1 C109.1 FB5.2 U7.1(AVDDH) U7.12(AVDDH) U7.47(AVDDH)
VDD_1V2_ETH: C33.1 C100.1 C105.1 C106.1 C111.1 C115.1 FB6.1 FB7.1 U7.14(DVDDL) U7.18(DVDDL) U7.23(DVDDL) U7.26(DVDDL) U7.30(DVDDL) U7.39(DVDDL)
VDD_3V3: C11.1 C67.1 FB3.1 FB5.1 R10.1 R11.1 R15.2 R22.1 R30.1 R31.1 R32.1 R34.1 R87.2 R88.2 U4.1(EN) U4.4(VCC)  [project net VDD]
VDDH_3V3: C10.1 C99.1 C110.1 FB3.2 R37.1 U7.16(DVDDH) U7.34(DVDDH) U7.40(DVDDH)
VPLL_1V2: C13.1 C96.1 FB6.2 U7.44(AVDDL_PLL)
AM335X_RGMII1_RXCLK: R24.1 U7.35(RX_CLK_PHYAD2) ; off-sheet AM335X_RGMII1_RXCLK  [also labelled ENET_RX_CLK]
AM335X_RGMII1_RXD0: R32.2 U7.32(RXD0_MODE0) ; off-sheet AM335X_RGMII1_RXD0  [also labelled ENET_RXD0]
AM335X_RGMII1_RXD1: R31.2 U7.31(RXD1_MODE1) ; off-sheet AM335X_RGMII1_RXD1  [also labelled ENET_RXD1]
AM335X_RGMII1_RXD2: R30.2 U7.28(RXD2_MODE2) ; off-sheet AM335X_RGMII1_RXD2  [also labelled ENET_RXD2]
AM335X_RGMII1_RXD3: R34.2 U7.27(RXD3_MODE3) ; off-sheet AM335X_RGMII1_RXD3  [also labelled ENET_RXD3]
AM335X_RGMII1_RXDV: R23.1 U7.33(RX_DV_CLK125_EN) ; off-sheet AM335X_RGMII1_RXDV  [also labelled ENET_RX_DV]
CLK125_NDO_LED_MODE: R9.1 U7.41(CLK125_NDO_LED_MODE)
ENET_GTX_CLK: U7.24(GTX_CLK) ; off-sheet AM335X_RGMII1_TXCLK  [also labelled AM335X_RGMII1_TXCLK]
ENET_INTn: R11.2 U7.38(INT_N) ; off-sheet RGMII1_INT  [also labelled RGMII1_INT]
ENET_LED1_LINK: J1.13(GRN_K) R37.2 U7.17(LED1_PHYAD0)
ENET_LED2_LINK: J1.15(YEL_K) R36.1 U7.15(LED2_PHYAD1)
ENET_MDC: R22.2 U7.36(MDC) ; off-sheet AM335X_RGMII1_MDIO_CLK  [also labelled AM335X_RGMII1_MDIO_CLK]
ENET_MDIO: R10.2 U7.37(MDIO) ; off-sheet AM335X_RGMII1_MDIO_DATA  [also labelled AM335X_RGMII1_MDIO_DATA]
ENET_RESETn: U7.42(RESET_N) ; off-sheet SYS_WARMRESETn  [also labelled SYS_WARMRESETn]
ENET_RSET: R6.2 U7.48(ISET)
ENET_TX_EN: U7.25(TX_EN) ; off-sheet AM335X_RGMII1_TXEN  [also labelled AM335X_RGMII1_TXEN]
ENET_TXD0: U7.19(TXD0) ; off-sheet AM335X_RGMII1_TXD0  [also labelled AM335X_RGMII1_TXD0]
ENET_TXD1: U7.20(TXD1) ; off-sheet AM335X_RGMII1_TXD1  [also labelled AM335X_RGMII1_TXD1]
ENET_TXD2: U7.21(TXD2) ; off-sheet AM335X_RGMII1_TXD2  [also labelled AM335X_RGMII1_TXD2]
ENET_TXD3: U7.22(TXD3) ; off-sheet AM335X_RGMII1_TXD3  [also labelled AM335X_RGMII1_TXD3]
GND_NET: C93.1 J1.10(AGND) R91.2
MDI_N0: J1.2(TD0_N) U7.3(TXRXM_A)
MDI_N1: J1.6(TD1_N) U7.6(TXRXM_B)
MDI_N2: J1.5(TD2_N) U7.8(TXRXM_C)
MDI_N3: J1.8(TD3_N) U7.11(TXRXM_D)
MDI_P0: J1.1(TD0_P) U7.2(TXRXP_A)
MDI_P1: J1.3(TD1_P) U7.5(TXRXP_B)
MDI_P2: J1.4(TD2_P) U7.7(TXRXP_C)
MDI_P3: J1.7(TD3_P) U7.10(TXRXP_D)
NetJ1_9: J1.9(VCC) R15.1
NetJ1_14: J1.14(GRN_A) R87.1
NetJ1_16: J1.16(YEL_A) R88.1
NetR8_1: R8.1 U4.3(OUT)
NetR8_2: R8.2 U7.46(XI)

Not connected (* = marked no-connect by the designer): U7 43(LDO_O)* 45(XO)*

### Notes on the sheet
- Configuration selected:
  Single LED mode
  RGMII interface advertising 10/100/1000 Full & Half Duplex
  PHY ADDR[4..0] = 00001
- Embedded Vision Systems Group
- School of Electrical and Electronic Engineering
- Size
- Title
- Document Number
- Rev
- Date:
- Sheet
- of
- (in symbol KSZ9021RN_4, part A) MDI INTERFACE

### Library data of the parts
?#9 = Title Block Address(1): UoM title block
C10 C106 = CAP: NON-POLARISED CAP
C11-C13 C21 C27 C32 C33 C67 C90 C93 C96 C99 C100 C104 C105 C109-C111 C115 = CAP: NON-POLARISED CAP; Part Field 1: 1; Part Field 10: 1000u; Part Field 2: 0; Part Field 3: 0; Part Field 4: 0; Part Field 5: 1; Part Field 6: 1000K; Part Field 7: 1u; Part Field 8: 1u; Part Field 9: 500u
FB3 FB5-FB7 = WE_74279265: Wurth Eleckronik 0603 ferrite bead pn 74279265
J1 = WE_7499111121A RJ45 triple speed: RJ45 Mag Jack triple speed
R6 R8-R11 R15 R22-R24 R30-R32 R34 R36 R37 R87-R89 R91 = RES: RESISTOR
U4 = OSC: XTAL OSCILLATOR MODULE
U7 = KSZ9021RN_4

## Sheet Pg10_ NAND_SDMMC Interface.SchDoc: NAND & SD CARD
size A2; DocumentNumber: 10; Revision: C2; SheetNumber: 10; SheetTotal: 16
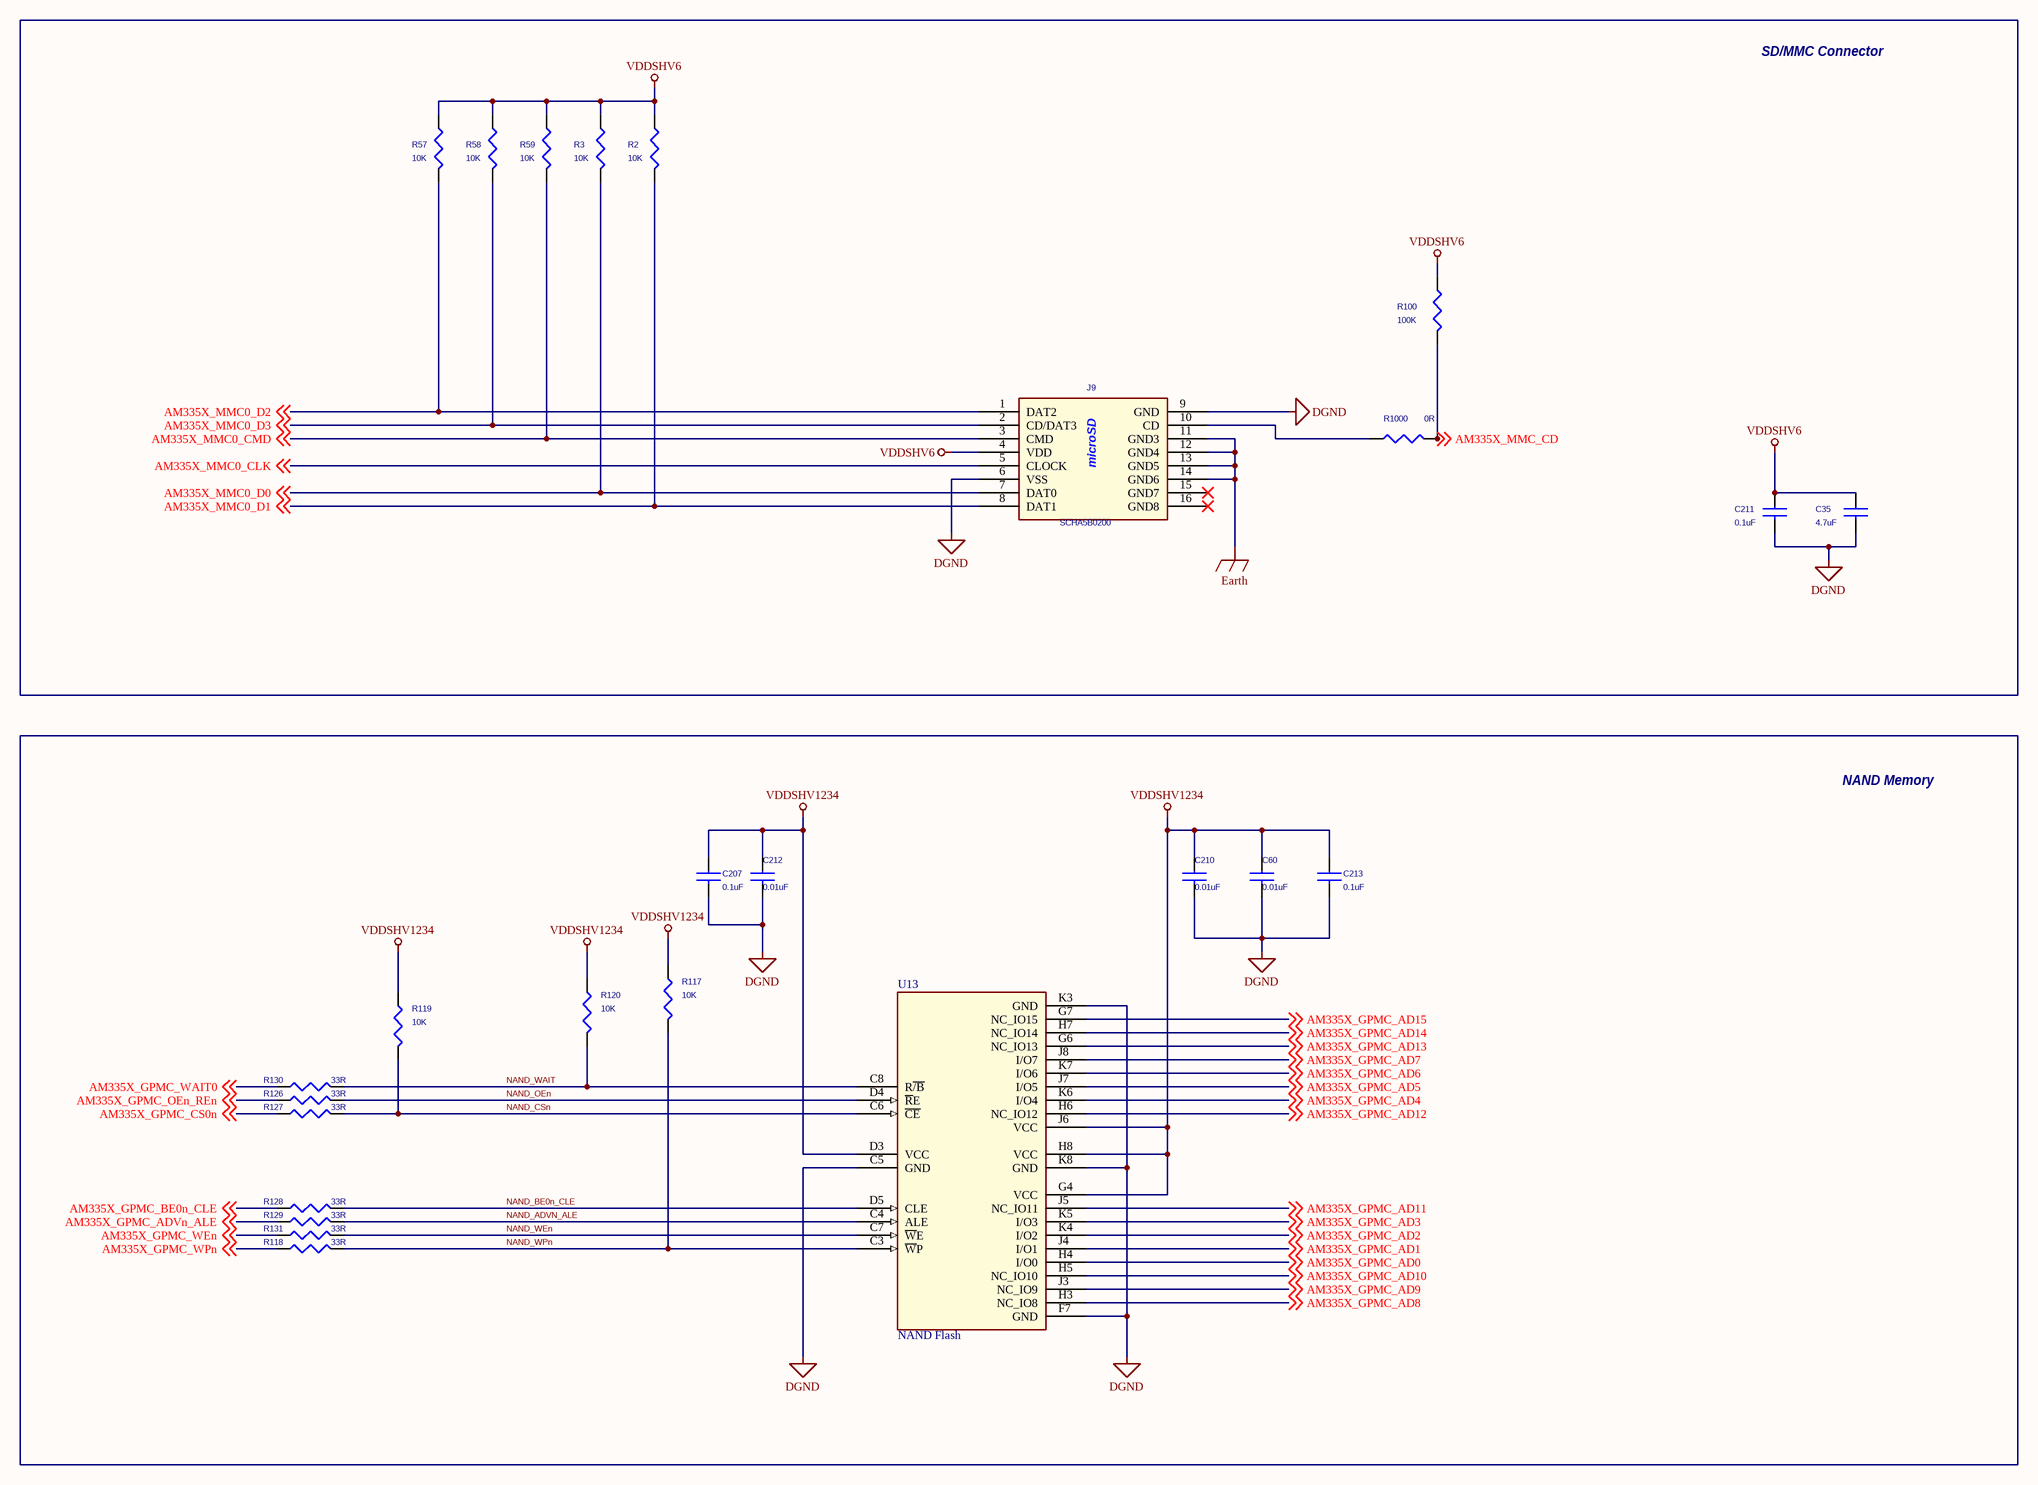
[diagram p12: Pg10_ NAND_SDMMC Interface.SchDoc]

### Parts
(Parts that share a designator on the sheet are numbered #1, #2 ... from top to bottom, then left to right.)
?#10  (no value)  (graphical)
C35  4.7uF  [SM-7351-CAP-0603]
C60  0.01uF  [SM-7351-CAP-0402]
C207  0.1uF  [SM-7351-CAP-0402]
C210  0.01uF  [SM-7351-CAP-0402]
C211  0.1uF  [SM-7351-CAP-0402]
C212  0.01uF  [SM-7351-CAP-0402]
C213  0.1uF  [SM-7351-CAP-0402]
J9  SCHA5B0200  [micro SD]
R2  10K  [SM-7351-RES-0402]
R3  10K  [SM-7351-RES-0402]
R57  10K  [SM-7351-RES-0402]
R58  10K  [SM-7351-RES-0402]
R59  10K  [SM-7351-RES-0402]
R100  100K  [SM-7351-RES-0402]
R117  10K  [SM-7351-RES-0402]
R118  33R  [SM-7351-RES-0402]
R119  10K  [SM-7351-RES-0402]
R120  10K  [SM-7351-RES-0402]
R126  33R  [SM-7351-RES-0402]
R127  33R  [SM-7351-RES-0402]
R128  33R  [SM-7351-RES-0402]
R129  33R  [SM-7351-RES-0402]
R130  33R  [SM-7351-RES-0402]
R131  33R  [SM-7351-RES-0402]
R1000  0R  [SM-7351-RES-0402]
U13  NAND Flash  [VFBGA - 63]

### Blocks framed on the sheet
SD/MMC Connector: C35 C211 J9 R2 R3 R57-R59 R100 R1000
NAND Memory: C60 C207 C210 C212 C213 R117-R120 R126-R131 U13

### Nets
DGND: C35.2 C60.2 C207.2 C210.2 C211.2 C212.2 C213.2 J9.6(VSS) J9.9(GND) U13.C5(GND) U13.F7(GND) U13.K3(GND) U13.K8(GND)
Earth: J9.11(GND3) J9.12(GND4) J9.13(GND5) J9.14(GND6)
VDDSHV6: C35.1 C211.1 J9.4(VDD) R2.2(P2) R3.2(P2) R57.2(P2) R58.2(P2) R59.2(P2) R100.2(P2)
VDDSHV1234: C60.1 C207.1 C210.1 C212.1 C213.1 R117.2(P2) R119.2(P2) R120.2(P2) U13.D3(VCC) U13.G4(VCC) U13.H8(VCC) U13.J6(VCC)
AM335X_GPMC_AD0: U13.H4(I/O0) ; off-sheet AM335X_GPMC_AD0  [project net GPMC_D0]
AM335X_GPMC_AD1: U13.J4(I/O1) ; off-sheet AM335X_GPMC_AD1  [project net GPMC_D1]
AM335X_GPMC_AD2: U13.K4(I/O2) ; off-sheet AM335X_GPMC_AD2  [project net GPMC_D2]
AM335X_GPMC_AD3: U13.K5(I/O3) ; off-sheet AM335X_GPMC_AD3  [project net GPMC_D3]
AM335X_GPMC_AD4: U13.K6(I/O4) ; off-sheet AM335X_GPMC_AD4  [project net GPMC_D4]
AM335X_GPMC_AD5: U13.J7(I/O5) ; off-sheet AM335X_GPMC_AD5  [project net GPMC_D5]
AM335X_GPMC_AD6: U13.K7(I/O6) ; off-sheet AM335X_GPMC_AD6  [project net GPMC_D6]
AM335X_GPMC_AD7: U13.J8(I/O7) ; off-sheet AM335X_GPMC_AD7  [project net GPMC_D7]
AM335X_GPMC_AD8: U13.H3(NC_IO8) ; off-sheet AM335X_GPMC_AD8  [project net GPMC_D8]
AM335X_GPMC_AD9: U13.J3(NC_IO9) ; off-sheet AM335X_GPMC_AD9  [project net GPMC_D9]
AM335X_GPMC_AD10: U13.H5(NC_IO10) ; off-sheet AM335X_GPMC_AD10  [project net GPMC_D10]
AM335X_GPMC_AD11: U13.J5(NC_IO11) ; off-sheet AM335X_GPMC_AD11  [project net GPMC_D11]
AM335X_GPMC_AD12: U13.H6(NC_IO12) ; off-sheet AM335X_GPMC_AD12  [project net GPMC_D12]
AM335X_GPMC_AD13: U13.G6(NC_IO13) ; off-sheet AM335X_GPMC_AD13  [project net GPMC_D13]
AM335X_GPMC_AD14: U13.H7(NC_IO14) ; off-sheet AM335X_GPMC_AD14  [project net GPMC_D14]
AM335X_GPMC_AD15: U13.G7(NC_IO15) ; off-sheet AM335X_GPMC_AD15  [project net GPMC_D15]
AM335X_GPMC_ADVn_ALE: R129.2(P2) ; off-sheet AM335X_GPMC_ADVn_ALE  [project net GPMC_ALE]
AM335X_GPMC_BE0n_CLE: R128.2(P2) ; off-sheet AM335X_GPMC_BE0n_CLE  [project net GPMC_BE0]
AM335X_GPMC_CS0n: R127.2(P2) ; off-sheet AM335X_GPMC_CS0n  [project net GPMC_NCS0]
AM335X_GPMC_OEn_REn: R126.2(P2) ; off-sheet AM335X_GPMC_OEn_REn  [project net GPMC_NOE]
AM335X_GPMC_WAIT0: R130.2(P2) ; off-sheet AM335X_GPMC_WAIT0  [project net GPMC_WAIT0]
AM335X_GPMC_WEn: R131.2(P2) ; off-sheet AM335X_GPMC_WEn  [project net GPMC_NWE]
AM335X_GPMC_WPn: R118.2(P2) ; off-sheet AM335X_GPMC_WPn  [project net GPMC_NWP]
AM335X_MMC0_CLK: J9.5(CLOCK) ; off-sheet AM335X_MMC0_CLK
AM335X_MMC0_CMD: J9.3(CMD) R59.1(P1) ; off-sheet AM335X_MMC0_CMD
AM335X_MMC0_D0: J9.7(DAT0) R3.1(P1) ; off-sheet AM335X_MMC0_D0
AM335X_MMC0_D1: J9.8(DAT1) R2.1(P1) ; off-sheet AM335X_MMC0_D1
AM335X_MMC0_D2: J9.1(DAT2) R57.1(P1) ; off-sheet AM335X_MMC0_D2
AM335X_MMC0_D3: J9.2(CD/DAT3) R58.1(P1) ; off-sheet AM335X_MMC0_D3
AM335X_MMC_CD: R100.1(P1) R1000.1(P1) ; off-sheet AM335X_MMC_CD
NAND_ADVN_ALE: R129.1(P1) U13.C4(ALE)
NAND_BE0n_CLE: R128.1(P1) U13.D5(CLE)
NAND_CSn: R119.1(P1) R127.1(P1) U13.C6(~{CE})
NAND_OEn: R126.1(P1) U13.D4(~{R}E)
NAND_WAIT: R120.1(P1) R130.1(P1) U13.C8(R~{/B})
NAND_WEn: R131.1(P1) U13.C7(~{W}E)
NAND_WPn: R117.1(P1) R118.1(P1) U13.C3(~{W}P)
NetJ9_10: J9.10(CD) R1000.2(P2)

Not connected (* = marked no-connect by the designer): J9 15(GND7)* 16(GND8)*

### Notes on the sheet
- Embedded Vision Systems Group
- Title
- School of Electrical and Electronic Engineering
- Date:
- Size
- Document Number
- Sheet
- of
- Rev
- (in symbol Conn_microSD_8) microSD

### Library data of the parts
?#10 = Title Block Address(1): UoM title block
C35 = 4.7uFCapacitor16V10%0603: as C62 on sheet Pg07_ DDR3_Memory
C60 C210 C212 = 0.01uFCapacitor16V10%0402: TIIntPartnumber: 1C0012; MfrNum: ECJ-0YB1C103K; PartName: 0.01uF16V10%SMD0402; Mfr: Panasonic; DescriptiveText: Capacitor 0.01uF 16V 10% 0402; Cost10K: 0.015; Cost100: 0.00; Vendor: Digikey; TN: 207-0054-000; PN: 0402YC103KAT2A
C207 C213 = 0.1uFCapacitor16V10%0402: TIIntPartnumber: 1C0089; MfrNum: C0402C104K4RACT; Mfr: Kemet; PartName: 0.1uF16V10%SMD0402; DescriptiveText: Capacitor 0.1uF 16V 10% 0402 X7R; Cost10K: 0.015; Cost100: 0.11; Vendor: Digikey
C211 = 0.1uFCapacitor16V10%0402_Dup1: as C16 on sheet Pg07_ DDR3_Memory
J9 = Conn_microSD_8: TIIntPartnumber: 2C0102; Mfr: ALPS; PartName: Conn_microSD_SCHA5B0200; DescriptiveText: Connector compact low-profile Push Type Micro SD; Cost10K: x.00; Vendor: Mouser; Cost100: x.00; MfrNum: SCHA5B0200
R2 R3 R57-R59 = 10KOhmResistor1/16W0402_Dup1: Resistor 10Kohm 1/16W 5% 0402; TIIntPartnumber: 1R0168; MfrNum: MCR01MZPJ103; Mfr: Rohm; PartName: 10Kohm1/16W5%SMD0402; Cost10K: 0.0017; Cost100: 0.03; Vendor: Digikey; Descriptive_Text: Resistor 10Kohm 1/16W 5% 0402; DescriptiveText: Resistor 10Kohm 1/16W 5% 0402
R100 R1000 = 470Kohm1/16W1%SMD0402: Resistor 470Kohm 1/16W 1% 0402; TIIntPartnumber: 1R0190; MfrNum: RMCF0402FT470K; Mfr: Stackpole Electronics; Cost10K: 0.00275; Cost100: 0.0105; Vendor: Digikey; DescriptiveText: Resistor 470Kohm 1/16W 1% 0402; PartName: 470Kohm1/16W1%SMD0402; Descriptive_Text: Resistor 470Kohm 1/16W 1% 0402
R117-R120 R126-R131 = 10KOhmResistor1/16W0402: TIIntPartnumber: 1R0168; MfrNum: MCR01MZPJ103; Mfr: Rohm; PartName: 10Kohm1/16W5%SMD0402; Cost10K: 0.0017; Cost100: 0.03; Vendor: Digikey; DescriptiveText: Resistor 10Kohm 1/16W 5% 0402
U13 = NAND Flash: MT29F2Gxx; PartNumber: 557-1486-2-ND; Seller: Digikey; Supplier: MT29F2Gxx

## Sheet Pg11_ USB1.SchDoc: USB OTG & HOST
size A2; DocumentNumber: 11; Revision: C2; SheetNumber: 11; SheetTotal: 16
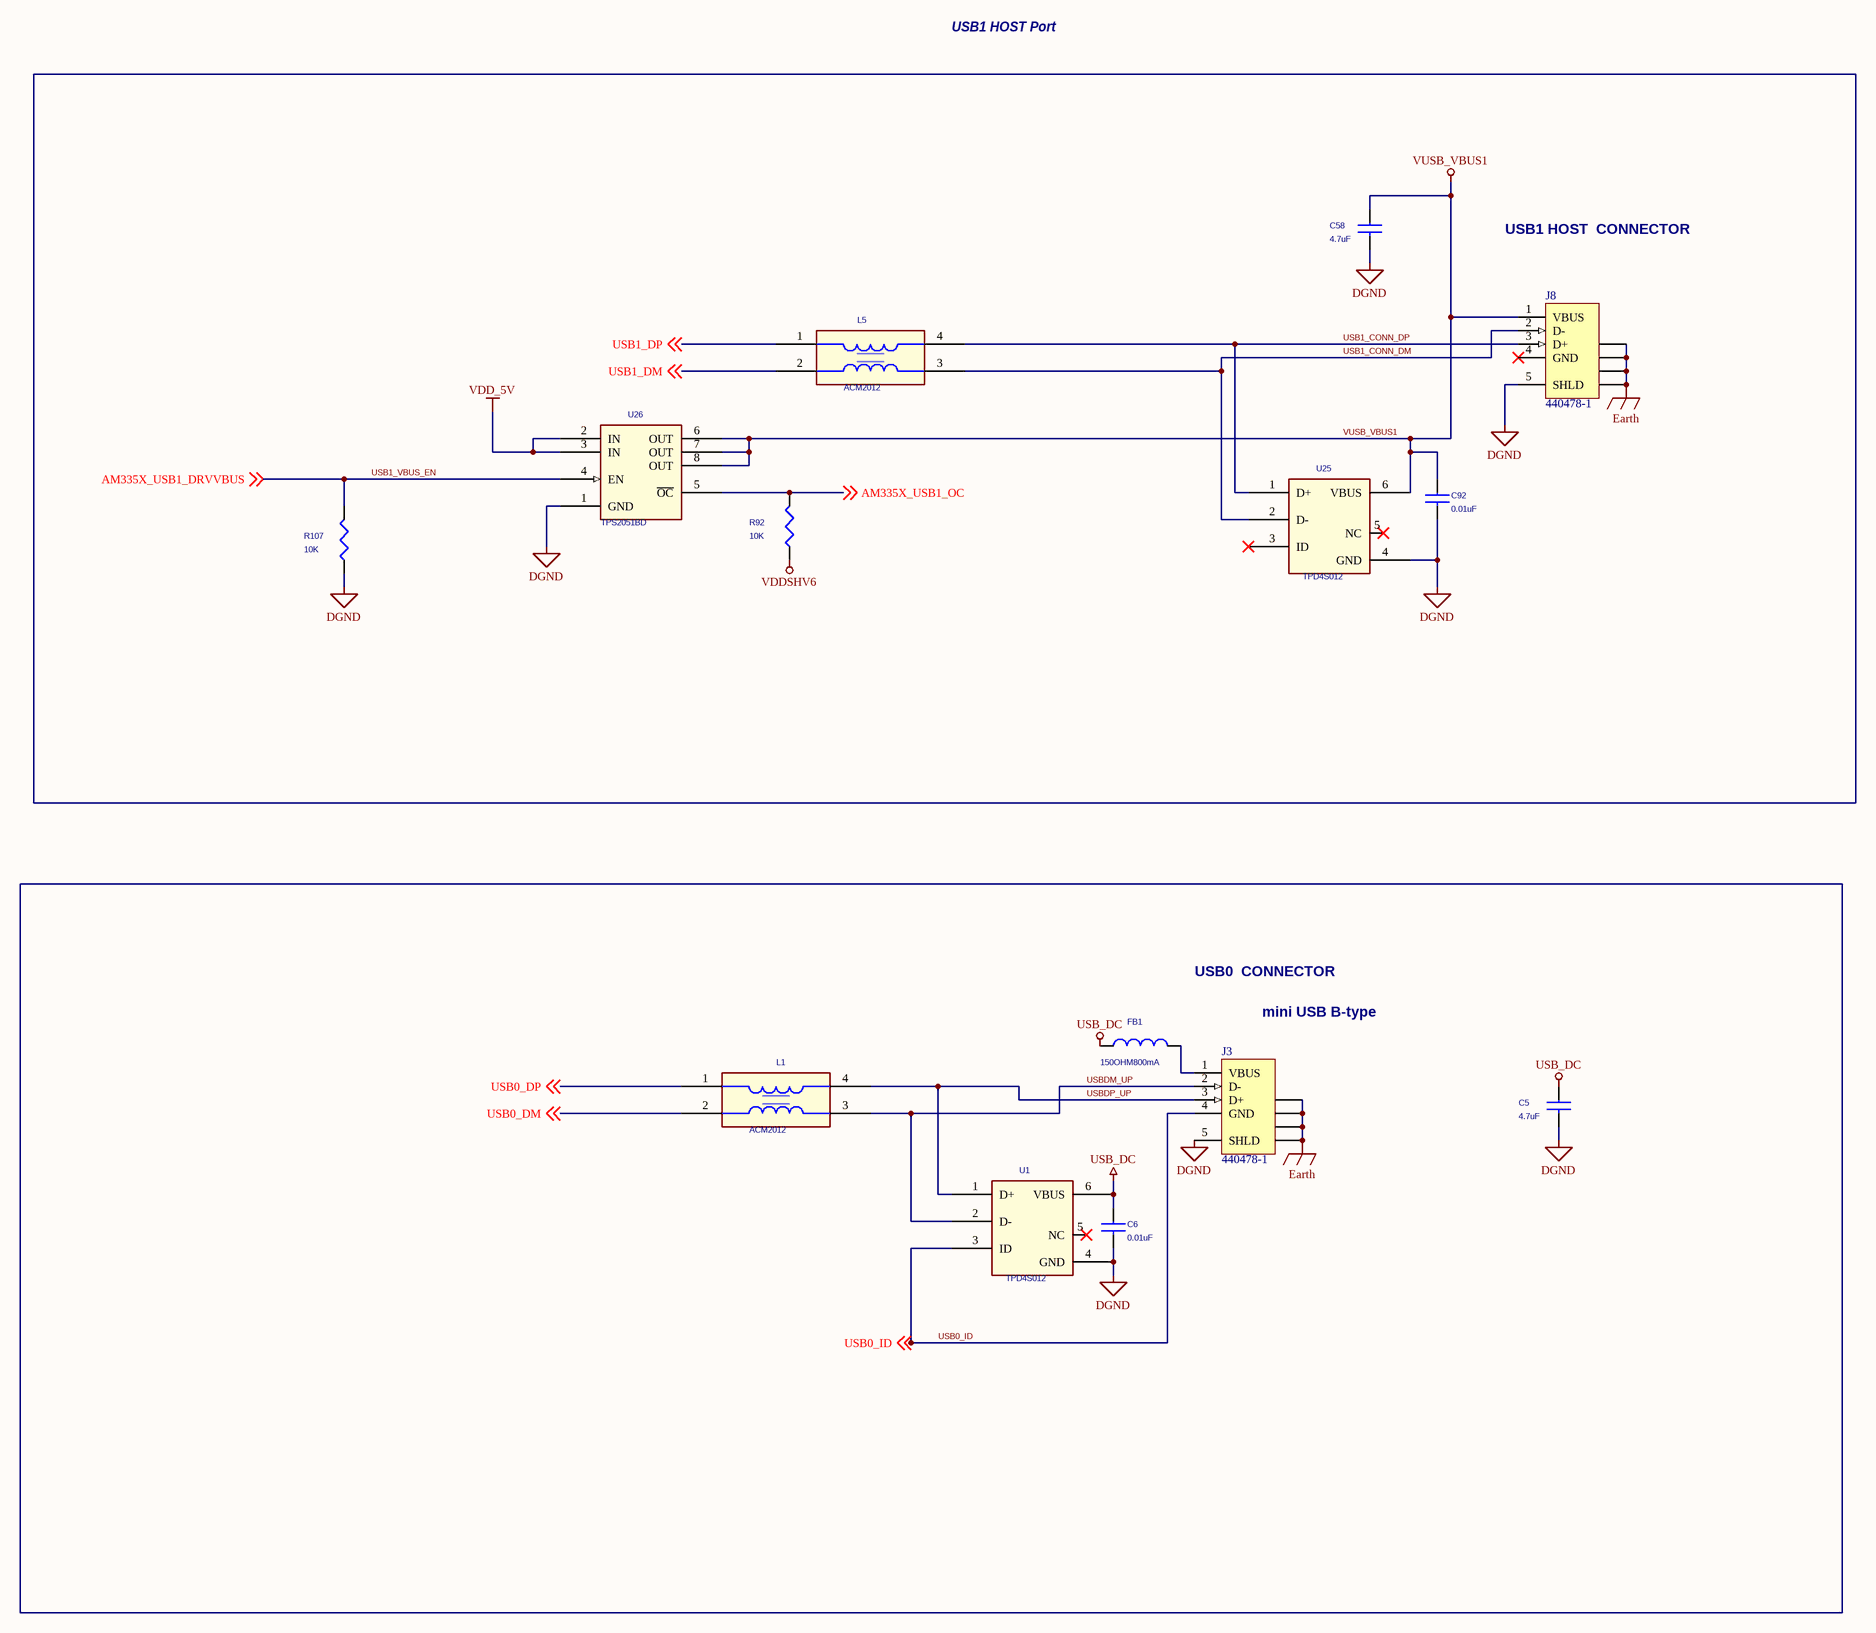
[diagram p13: Pg11_ USB1.SchDoc]

### Parts
(Parts that share a designator on the sheet are numbered #1, #2 ... from top to bottom, then left to right.)
?#11  (no value)  (graphical)
C5  4.7uF  [SM-7351-CAP-0603]
C6  0.01uF  [SM-7351-CAP-0402]
C58  4.7uF  [SM-7351-CAP-0603]
C92  0.01uF  [SM-7351-CAP-0402]
FB1  150OHM800mA  [sm-7351-ind-0805]
J3  440478-1  [440478]
J8  440478-1  [440478]
L1  ACM2012  [ACM2012H]
L5  ACM2012  [ACM2012H]
R92  10K  [SM-7351-RES-0402]
R107  10K  [SM-7351-RES-0402]
U1  TPD4S012  [U_6_DRY]
U25  TPD4S012  [U_6_DRY]
U26  TPS2051BD  [U_8_D]

### Blocks framed on the sheet
USB1 HOST  CONNECTOR: C58 C92 J8 L5 R92 R107 U25 U26

### Nets
DGND: C5.2 C6.2 C58.2 C92.2 J3.5(SHLD) J8.5(SHLD) R107.2(P2) U1.4(GND) U25.4(GND) U26.1(GND)
Earth: J3.6(SHLD) J3.7(SHLD) J3.8(SHLD) J3.9(SHLD) J8.6(SHLD) J8.7(SHLD) J8.8(SHLD) J8.9(SHLD)
USB_DC: C5.1 C6.1 FB1.1 U1.6(VBUS)
VDD_5V: U26.2(IN) U26.3(IN)
VDDSHV6: R92.2(P2)
VUSB_VBUS1: C58.1 C92.1 J8.1(VBUS) U25.6(VBUS) U26.6(OUT) U26.7(OUT) U26.8(OUT)  [project net AM335X_USB1_VBUS]
AM335X_USB1_DRVVBUS: R107.1(P1) U26.4(EN) ; off-sheet AM335X_USB1_DRVVBUS  [also labelled USB1_VBUS_EN]
AM335X_USB1_OC: R92.1(P1) U26.5(~{OC}) ; off-sheet AM335X_USB1_OC  [project net TST2]
USB0_DM: L1.2 ; off-sheet USB0_DM
USB0_DP: L1.1 ; off-sheet USB0_DP
USB0_ID: J3.4(GND) U1.3(ID) ; off-sheet USB0_ID
USB1_CONN_DM: J8.2(D-) L5.3 U25.2(D-)
USB1_CONN_DP: J8.3(D+) L5.4 U25.1(D+)
USB1_DM: L5.2 ; off-sheet USB1_DM
USB1_DP: L5.1 ; off-sheet USB1_DP
USBDM_UP: J3.2(D-) L1.3 U1.2(D-)
USBDP_UP: J3.3(D+) L1.4 U1.1(D+)
NetFB1_2: FB1.2 J3.1(VBUS)

Not connected (* = marked no-connect by the designer): J8 4(GND)*; U1 5(NC)*; U25 3(ID)* 5(NC)*

### Notes on the sheet
- USB1 HOST Port
- USB0  CONNECTOR
- (near J3) mini USB B-type
- Embedded Vision Systems Group
- Title
- School of Electrical and Electronic Engineering
- Date:
- Size
- Document Number
- Sheet
- of
- Rev

### Library data of the parts
?#11 = Title Block Address(1): UoM title block
C5 C58 = 4.7uFCapacitor16V10%0603: as C62 on sheet Pg07_ DDR3_Memory
C6 C92 = 0.01uFCapacitor16V10%0402_Dup1: Mfr: Panasonic; PartName: 0.01uF16V10%SMD0402; MfrNum: ECJ-0YB1C103K; TIIntPartnumber: 1C0012; PN: 0402YC103KAT2A; TN: 207-0054-000; Vendor: Digikey; Cost100: 0.00; Cost10K: 0.015; DescriptiveText: Capacitor 0.01uF 16V 10% 0402
FB1 = FerBead_3: Ferrite Bead 150 Ohm 800mA; Mfr: Steward; MfrNum: LI0805H151R-10; TIIntPartnumber: 1L0010; Vendor: Digikey; Cost100: 0.068; Cost10K: 0.045; DescriptiveText: Ferrite Bead 150 Ohm 800mA; PartName: FerriteBead150ohm800mA; Descriptive_Text: Ferrite Bead 150 Ohm 800mA
J3 J8 = 440478-1: USB 2.0, Right Angle, SMT, A Type, Receptacle, 5 Position, Black; ContactMaterial: Phosphor Bronze; ContactPlating: Gold (30) over Nickel; PCB_Layout: Complies with manufacturer's recommendation.; DrillSize: Corresponds to nominal value.; PanelGround: Without; Published: 15-Jul-2004; DatasheetDocument: 15-Nov-2002; PackageDocument: 15-Nov-2002; PackageReference: 440478; Publisher: Altium Limited; HousingMaterial: Thermoplastic; ComponentLink1Description: Manufacturer Link; ComponentLink1URL: http://www.tycoelectronics.com/; ComponentLink2Description: Packaging Specification; ComponentLink2URL: http://ecommas.tycoelectronics.com/commerce/DocumentDelivery/DDEController?Action=showdoc&DocId=Customer+Drawing%7F440478%7FB%7Fpdf%7FEnglish%7FC_440478_B.pdf
L1 L5 = ACM2012: Common Mode Filter for USB/HDMI; TIIntPartnumber: 1M0003; MfrNum: ACM2012H-900-2P; Mfr: TDK; Cost10K: 0.33; Cost100: 1.11; Vendor: Arrow; Descriptive_Text: Common Mode Filter for USB/HDMI; PartName: ACM2012; DescriptiveText: Common Mode Filter for USB/HDMI
R92 = 10KOhmResistor1/16W0402_Dup1: Resistor 10Kohm 1/16W 5% 0402; TIIntPartnumber: 1R0168; MfrNum: MCR01MZPJ103; Mfr: Rohm; PartName: 10Kohm1/16W5%SMD0402; Cost10K: 0.0017; Cost100: 0.03; Vendor: DIGIKEY; Descriptive_Text: Resistor 10Kohm 1/16W 5% 0402; DescriptiveText: Resistor 10Kohm 1/16W 5% 0402
R107 = 10KOhmResistor1/16W0402_Dup1: as R2 on sheet Pg10_ NAND_SDMMC Interface; Descriptive_Text: Resistor 10Kohm 1/16W 5% 0402; DescriptiveText: Resistor 10Kohm 1/16W 5% 0402
U1 U25 = TPD4S012: ESD 4channel USB Interface; Mfr: TI; MfrNum: TPD4S012DRY; TIIntPartnumber: 1A0233; Vendor: Digikey; Cost100: 0.76; Cost10K: 0.12; DescriptiveText: ESD 4channel USB Interface; PartName: TPD4S012; Descriptive_Text: ESD 4channel USB Interface
U26 = TPS2051BD: Power Distribution Switch Current Limited 500mA; Mfr: TI; TIIntPartnumber: 1A0286; Vendor: Digikey; Cost100: 1.70; Cost10K: 0.17; DescriptiveText: Power Distribution Switch Current Limited 500mA; PartName: TPS2051BD; MfrNum: TPS2051BD; Descriptive_Text: Power Distribution Switch Current Limited 500mA

## Sheet Pg12_USB_UART.SchDoc: UART - USB CONSOLE & JTAG
size A3; DocumentNumber: 12; Revision: C2; SheetNumber: 12; SheetTotal: 16
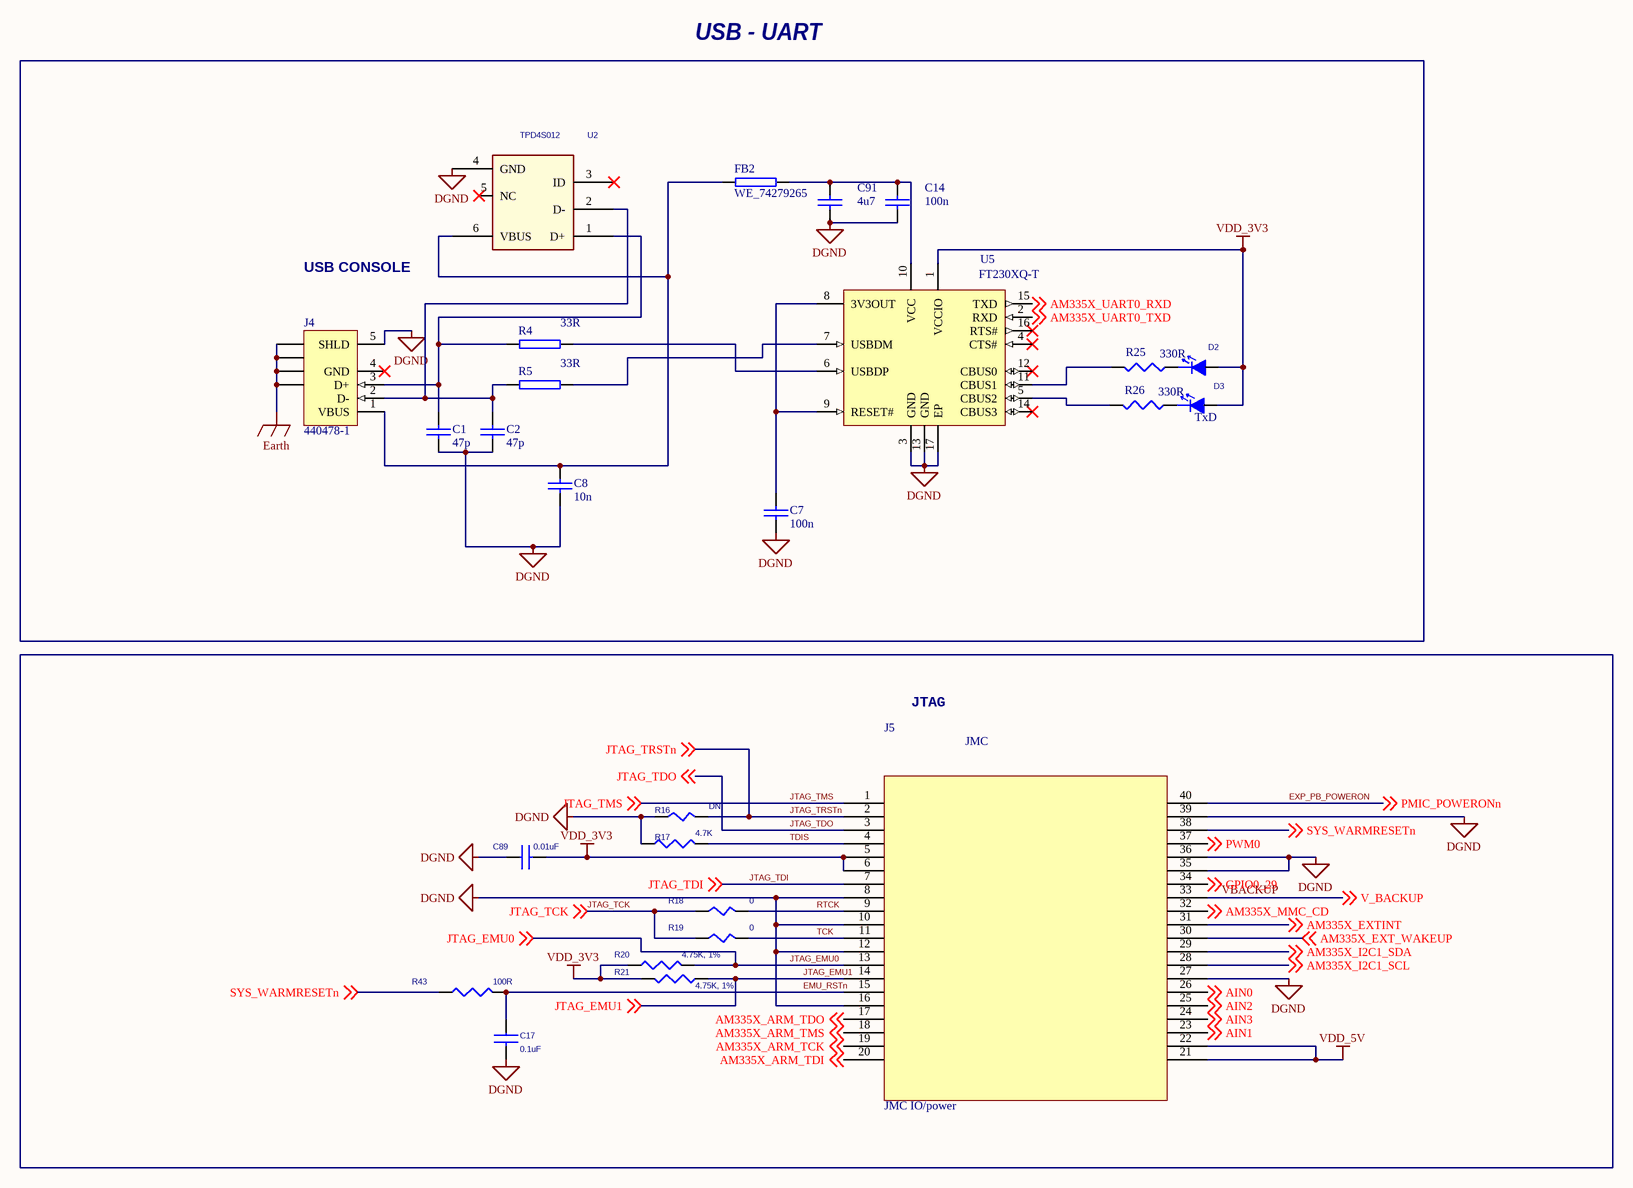
[diagram p14: Pg12_USB_UART.SchDoc]

### Parts
(Parts that share a designator on the sheet are numbered #1, #2 ... from top to bottom, then left to right.)
?#12  (no value)  (graphical)
C1  47p  [SM-7351-CAP-0402]
C2  47p  [SM-7351-CAP-0402]
C7  100n  [SM-7351-CAP-0402]
C8  10n  [SM-7351-CAP-0402]
C14  100n  [SM-7351-CAP-0402]
C17  0.1uF  [SM-7351-CAP-0402]
C89  0.01uF  [SM-7351-CAP-0402]
C91  4u7  [0603]
D2  Green LED  [0603]  (value not drawn)
D3  Green LED  [0603]  (value not drawn)
FB2  WE_74279265  [0603]
J4  440478-1  [440478]
J5  JMC IO/power  [40 Pin Female]
R4  33R  [SM-7351-RES-0402]
R5  33R  [SM-7351-RES-0402]
R16  DNI  [SM-7351-RES-0402]
R17  4.7K  [SM-7351-RES-0402]
R18  0  [SM-7351-RES-0402]
R19  0  [SM-7351-RES-0402]
R20  4.75K, 1%  [SM-7351-RES-0402]
R21  4.75K, 1%  [SM-7351-RES-0402]
R25  330R  [SM-7351-RES-0402]
R26  330R  [SM-7351-RES-0402]
R43  100R  [SM-7351-RES-0402]
U2  TPD4S012  [U_6_DRY]
U5  FT230XQ-T  [QFN-16_N]

### Blocks framed on the sheet
USB - UART: C1 C2 C7 C8 C14 C91 D2 D3 FB2 J4 R4 R5 R25 R26 U2 U5
JTAG: C17 C89 J5 R16-R21 R43

### Nets
DGND: C1.2 C2.2 C7.2 C8.2 C14.2 C17.2 C89.1 C91.2 J4.5(SHLD) J5.8 J5.10 J5.12 J5.16 J5.27 J5.35 J5.36 J5.39 R16.2(P2) R17.1 U2.4(GND) U5.3(GND) U5.13(GND) U5.17(EP)
Earth: J4.6(SHLD) J4.7(SHLD) J4.8(SHLD) J4.9(SHLD)
VDD_3V3: C89.2 D2.2(Anode) D3.2(Anode) J5.5 J5.6 R20.1 R21.2 U5.1(VCCIO)  [project net VDD]
VDD_5V: J5.21 J5.22
AIN0: J5.26 ; off-sheet AIN0
AIN1: J5.23 ; off-sheet AIN1
AIN2: J5.25 ; off-sheet AIN2
AIN3: J5.24 ; off-sheet AIN3
AM335X_ARM_TCK: J5.19 ; off-sheet AM335X_ARM_TCK  [project net ARM_TCK]
AM335X_ARM_TDI: J5.20 ; off-sheet AM335X_ARM_TDI  [project net ARM_TDI]
AM335X_ARM_TDO: J5.17 ; off-sheet AM335X_ARM_TDO  [project net ARM_TDO]
AM335X_ARM_TMS: J5.18 ; off-sheet AM335X_ARM_TMS  [project net ARM_TMS]
AM335X_EXT_WAKEUP: J5.30 ; off-sheet AM335X_EXT_WAKEUP
AM335x_EXTINT: J5.31 ; off-sheet AM335X_EXTINT
AM335X_I2C1_SCL: J5.28 ; off-sheet AM335X_I2C1_SCL  [project net SCL]
AM335X_I2C1_SDA: J5.29 ; off-sheet AM335X_I2C1_SDA  [project net SDA]
AM335X_MMC_CD: J5.32 ; off-sheet AM335X_MMC_CD
AM335X_UART0_RXD: U5.15(TXD) ; off-sheet AM335X_UART0_RXD
AM335X_UART0_TXD: U5.2(RXD) ; off-sheet AM335X_UART0_TXD
EMU_RSTn: C17.1 J5.15 R43.1(P1)
EXP_PB_POWERON: J5.40 ; off-sheet PMIC_POWERONn  [also labelled PMIC_POWERONn]
GPIO0_29: J5.34 ; off-sheet GPIO0_29
JTAG_EMU0: J5.13 R20.2 ; off-sheet JTAG_EMU0
JTAG_EMU1: J5.14 R21.1 ; off-sheet JTAG_EMU1
JTAG_TCK: R18.2(P2) R19.2(P2) ; off-sheet JTAG_TCK
JTAG_TDI: J5.7 ; off-sheet JTAG_TDI
JTAG_TDO: J5.3 ; off-sheet JTAG_TDO
JTAG_TMS: J5.1 ; off-sheet JTAG_TMS
JTAG_TRSTn: J5.2 R16.1(P1) ; off-sheet JTAG_TRSTn
PWM0: J5.37 ; off-sheet PWM0
RTCK: J5.9 R18.1(P1)
SYS_WARMRESETn: J5.38 R43.2(P2) ; off-sheet SYS_WARMRESETn  [project net ENET_RESETn]
TCK: J5.11 R19.1(P1)
TDIS: J5.4 R17.2
VBACKUP: J5.33 ; off-sheet V_BACKUP  [also labelled V_BACKUP]
NetC1_1: C1.1 J4.3(D+) R4.2 U2.1(D+)
NetC2_1: C2.1 J4.2(D-) R5.2 U2.2(D-)
NetC7_1: C7.1 U5.8(3V3OUT) U5.9(RESET#)
NetC8_1: C8.1 FB2.1 J4.1(VBUS) U2.6(VBUS)
NetC14_1: C14.1 C91.1 FB2.2 U5.10(VCC)
NetD2_1: D2.1(Cathode) R25.2(P2)
NetD3_1: D3.1(Cathode) R26.2(P2)
NetR4_1: R4.1 U5.6(USBDP)
NetR5_1: R5.1 U5.7(USBDM)
NetR25_1: R25.1(P1) U5.11(CBUS1)
NetR26_1: R26.1(P1) U5.5(CBUS2)

Not connected (* = marked no-connect by the designer): J4 4(GND)*; U2 3(ID)* 5(NC)*; U5 4(CTS#)* 12(CBUS0)* 14(CBUS3)* 16(RTS#)*

### Notes on the sheet
- USB CONSOLE
- (near D3) TxD
- Embedded Vision Systems Group
- School of Electrical and Electronic Engineering
- Size
- Title
- Document Number
- Rev
- Date:
- Sheet
- of
- (in symbol JMC 40-pin) JMC

### Library data of the parts
?#12 = Title Block Address(1): UoM title block
C1 C2 C7 C8 C14 C91 = CAP: NON-POLARISED CAP
C17 = 0.1uFCapacitor16V10%0402: PartName: 0.1uF16V10%SMD0402; Mfr: Kemet; MfrNum: C0402C104K4RACT; TIIntPartnumber: 1C0089; Vendor: Digikey; Cost100: 0.11; Cost10K: 0.015; DescriptiveText: Capacitor 0.1uF 16V 10% 0402 X7R
C89 = 0.01uFCapacitor16V10%0402_Dup1: as C6 on sheet Pg11_ USB1
D2 D3 = LED_Green: TIIntPartnumber: 1F0008; MfrNum: 598-8170-107F; Mfr: Dialight; PartName: LEDGreen2x1.5; DescriptiveText: LED Green SMD 20mA 2V 0805; Cost10K: 0.0370; Cost100: 0.081; Vendor: Digikey
FB2 = WE_74279265: as FB3 on sheet Pg09_1G_b
J4 = 440478-1: as J3 on sheet Pg11_ USB1; Published: 15-Jul-2004; DatasheetDocument: 15-Nov-2002; PackageDocument: 15-Nov-2002; PackageReference: 440478; Publisher: Altium Limited; HousingMaterial: Thermoplastic; ComponentLink1Description: Manufacturer Link; ComponentLink1URL: http://www.tycoelectronics.com/; ComponentLink2Description: Packaging Specification; ComponentLink2URL: http://ecommas.tycoelectronics.com/commerce/DocumentDelivery/DDEController?Action=showdoc&DocId=Customer+Drawing%7F440478%7FB%7Fpdf%7FEnglish%7FC_440478_B.pdf
J5 = JMC 40-pin: JST JMC 40 pin connector
R4 R5 = RES: RESISTOR
R16 R18 R19 = ZeroOhmResistor1/16W0402_Dup4: Resistor Zero ohm Jumper 0402; TIIntPartnumber: 1R0098; MfrNum: ERJ-2GE0R00X; Mfr: Panasonic; PartName: ZeroohmSMD0402; Cost10K: 0.0020; Cost100: 0.08; Vendor: Digikey; Descriptive_Text: Resistor Zero ohm Jumper 0402; DescriptiveText: Resistor Zero ohm Jumper 0402
R17 R20 R21 = 4.75KohmResistor1/16W1%0402: PartName: 4.75Kohm1/10W1%smd0402; Mfr: Panasonic-ECG; MfrNum: ERJ-2RKF4751X; TIIntPartnumber: 1R0250; Part Number: RES_4.75K_1/16W_1%_0402; Vendor: Digikey; Cost100: 0.02; Cost10K: 0.00132; DescriptiveText: Resistor 4.75KOHM 1/10W 1% 0402 SMD
R25 R26 = 1MOhmResistor1/16W0402: PartName: 1Mohm1/16W1%SMD0402; Mfr: Stackpole Electronics; MfrNum: RMCF0402FT1M00; TIIntPartnumber: 1R0182; Vendor: Digikey; Cost100: 0.0105; Cost10K: 0.00275; DescriptiveText: Resistor 1Mohm 1/16W 1% 0402
R43 = 100ohm1/16W1%SMD0402: TIIntPartnumber: 1R0236; MfrNum: RMCF0402JT100R; Mfr: Stackpole Electronics; PartName: 100ohm1/16W5%0402; DescriptiveText: Resistor 100ohm 1/16W 5% 0402; Cost10K: 0.00132; Cost100: 0.011; Vendor: Digikey
U2 = TPD4S012: as U1 on sheet Pg11_ USB1; DescriptiveText: ESD 4channel USB Interface; PartName: TPD4S012; Descriptive_Text: ESD 4channel USB Interface
U5 = FT230XQ-T: USB to Basic UART Interface Chip, UHCI/OHCI/EHCI Compatible, USB 2.0 Compatible, -40 to +85 degC, 16-Pin QFN, Pb-Free, Tray; Manufacturer: FTDI; DatasheetVersion: ver 1.2, Feb-2013; PackageVersion: Feb-13; PackageReference: QFN-16; PackageDescription: 16-Pin Quad Flat No-Lead, 4x4 mm Body, 0.65 mm Pitch; Code_JEDEC: MO-220WGGC; PartNumber: FT230XQ-T; ComponentLink1Description: Manufacturer URL; ComponentLink1URL: http://www.ftdichip.com/; ComponentLink2Description: Datasheet; ComponentLink2URL: http://www.ftdichip.com/Support/Documents/DataSheets/ICs/DS_FT230X.pdf; ComponentLink3Description: FT230X Product Page; ComponentLink3URL: www.ftdichip.com/Products/ICs/FT230X.html